# EAGLE design 612_jetracer_esp32s3_030011 (EAGLE 9.6.2)
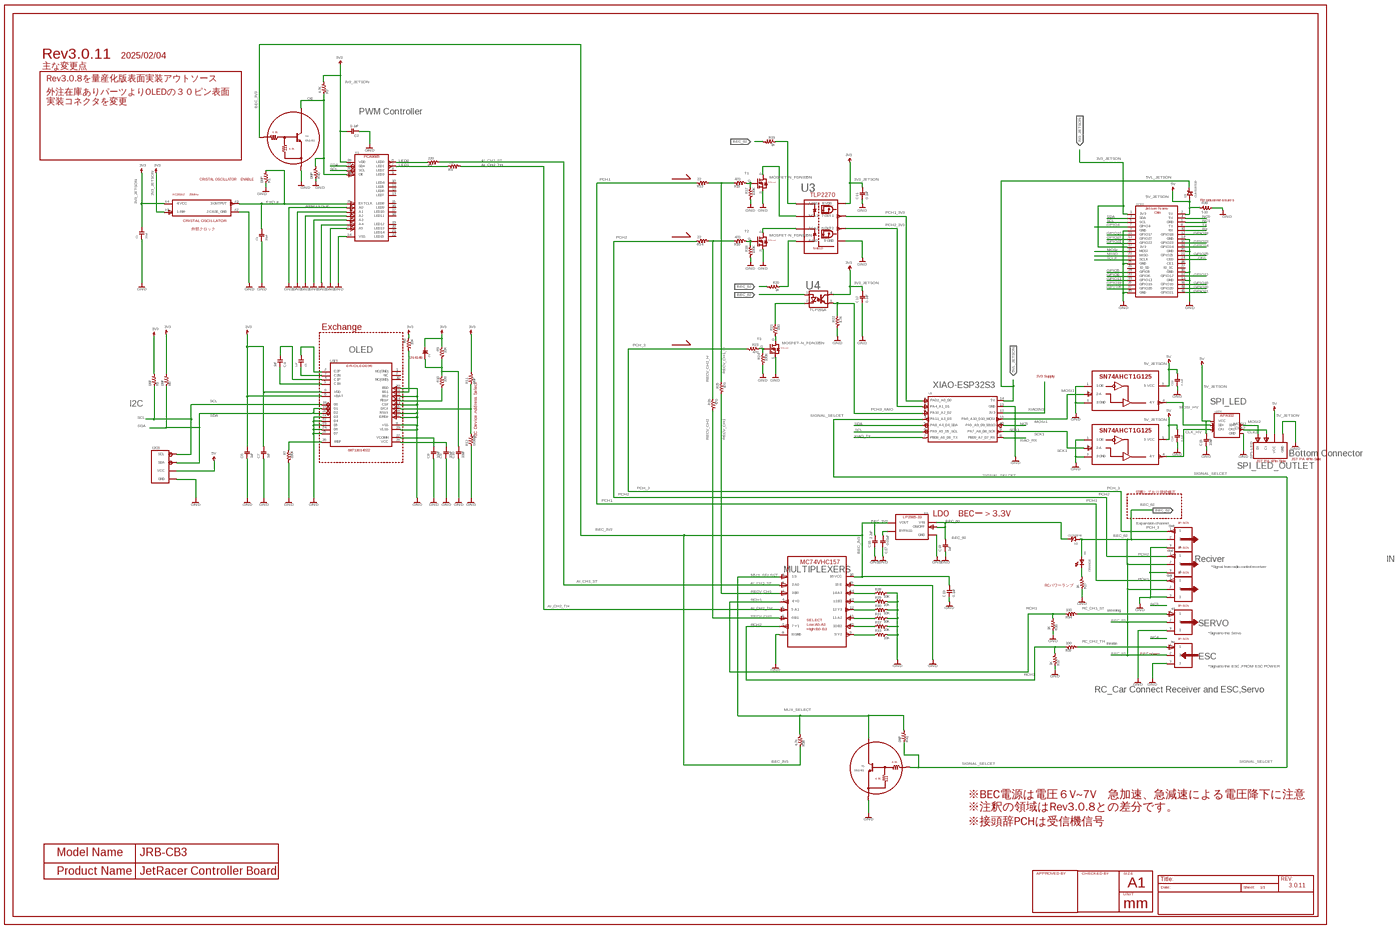
[diagram p0: schematic, sheet 1, overview]
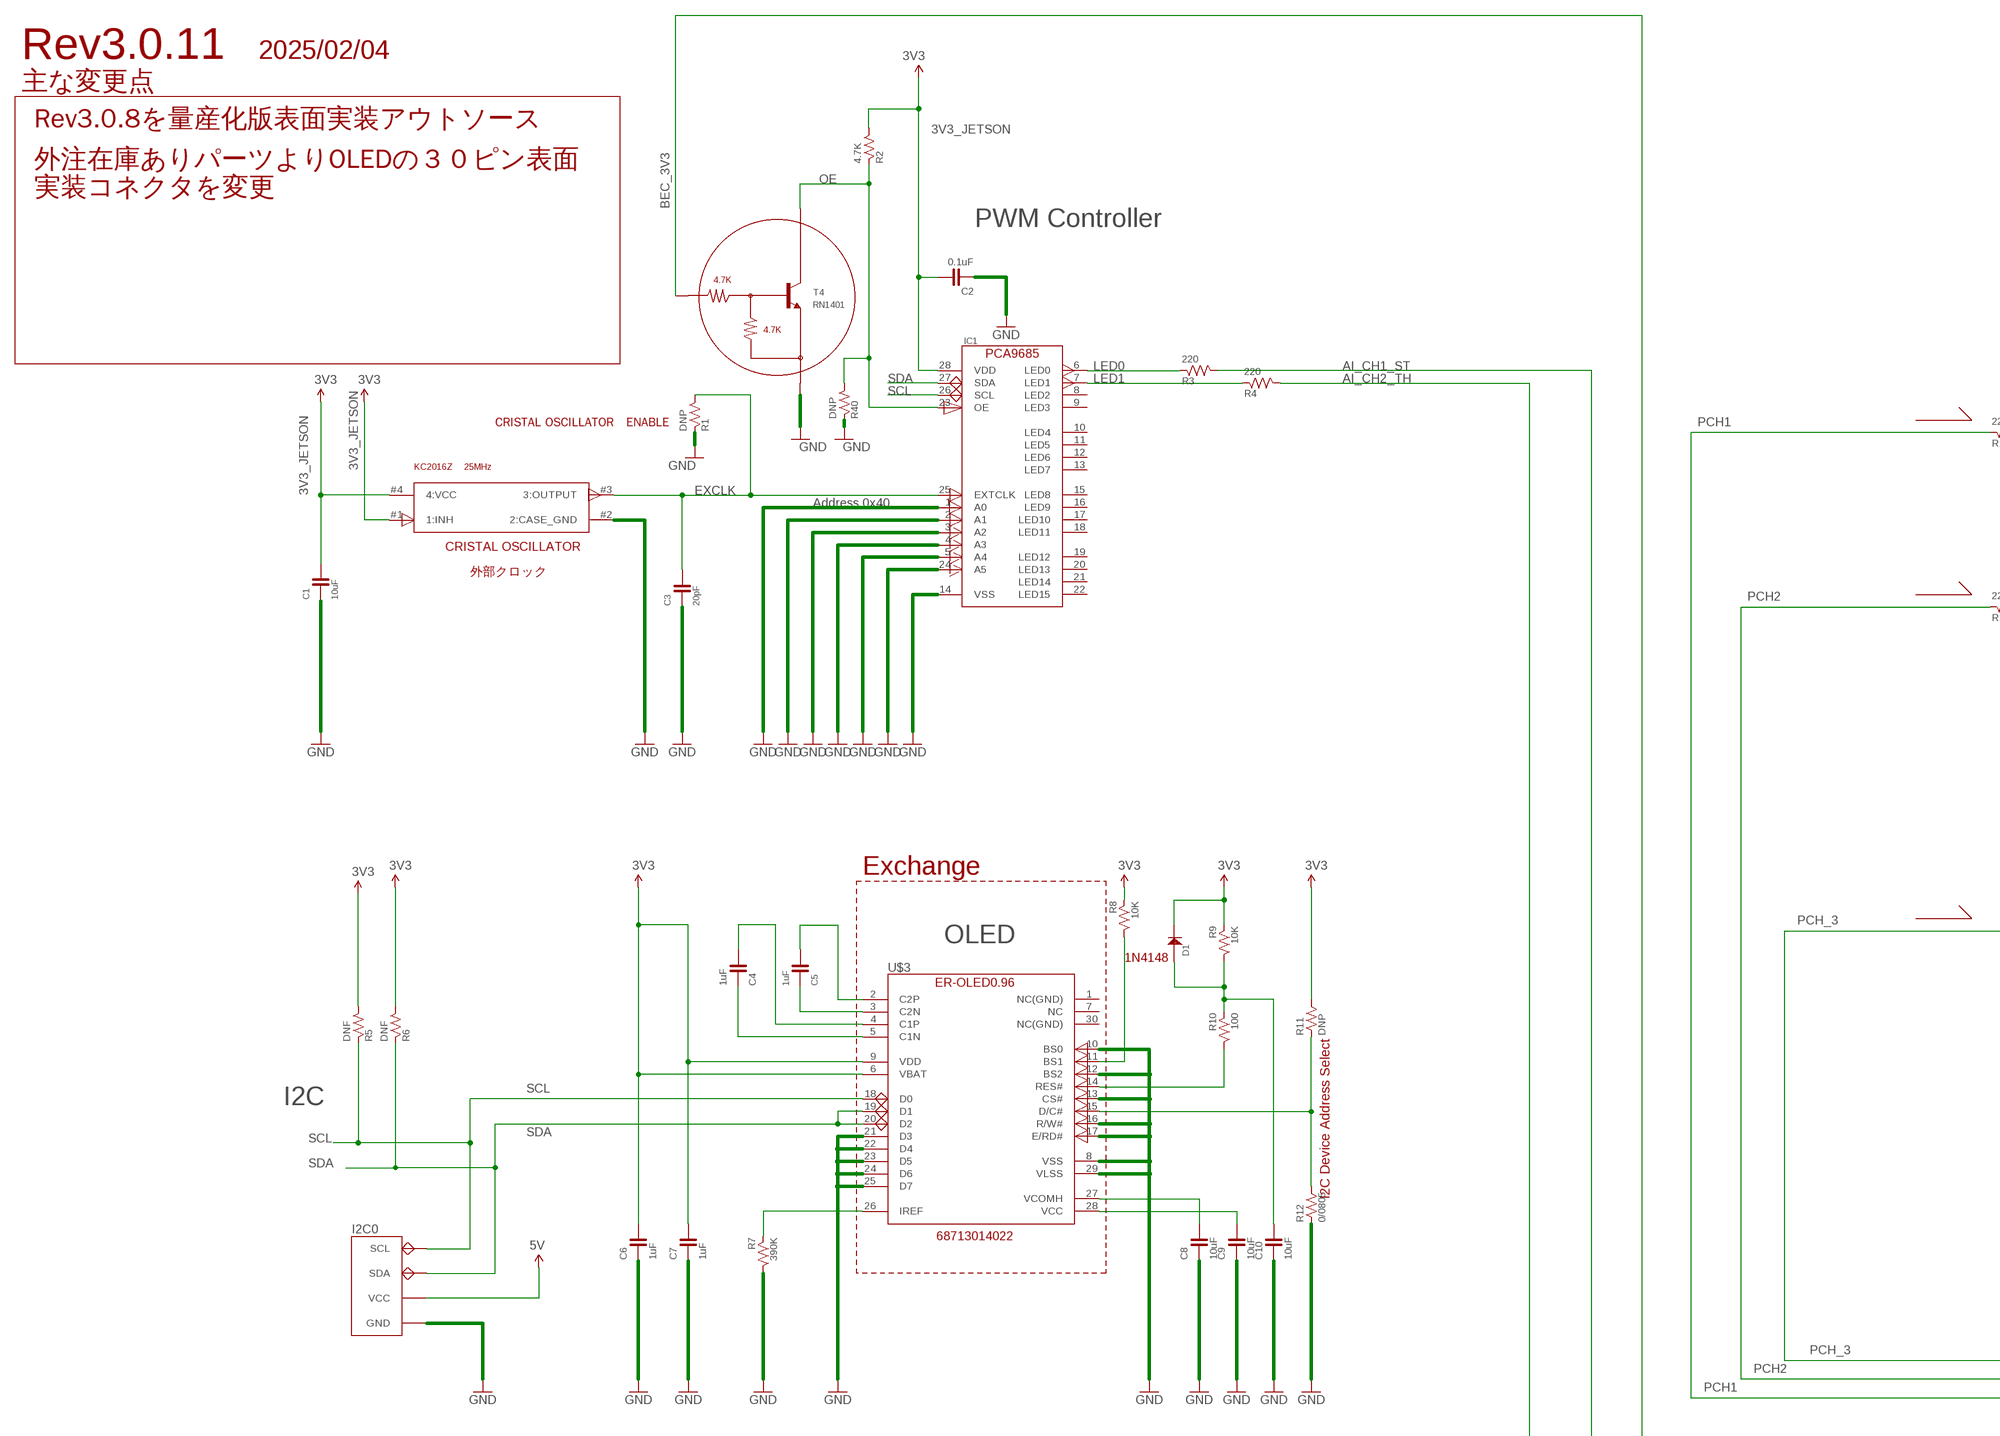
[diagram p1: schematic, sheet 1, part 1 of 4]
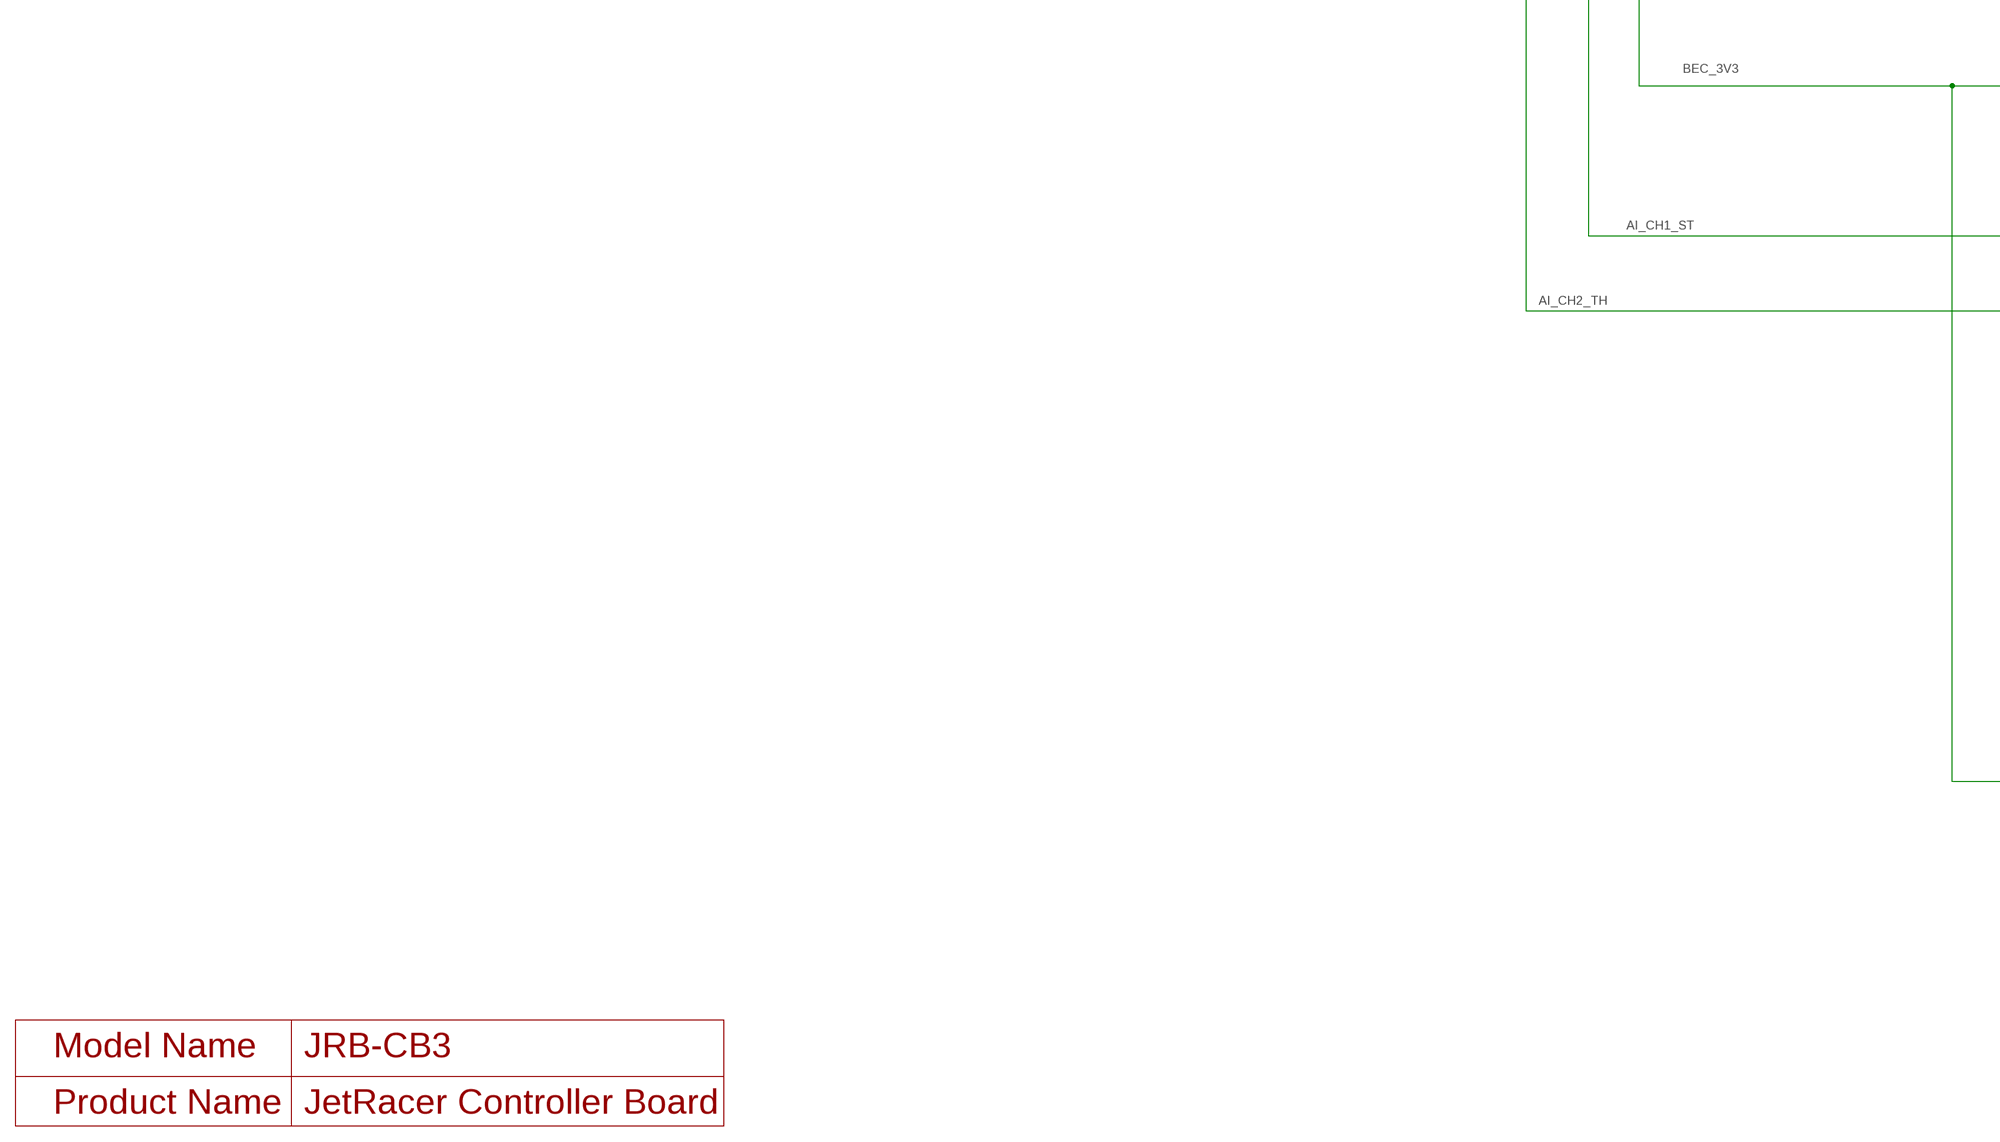
[diagram p2: schematic, sheet 1, part 2 of 4]
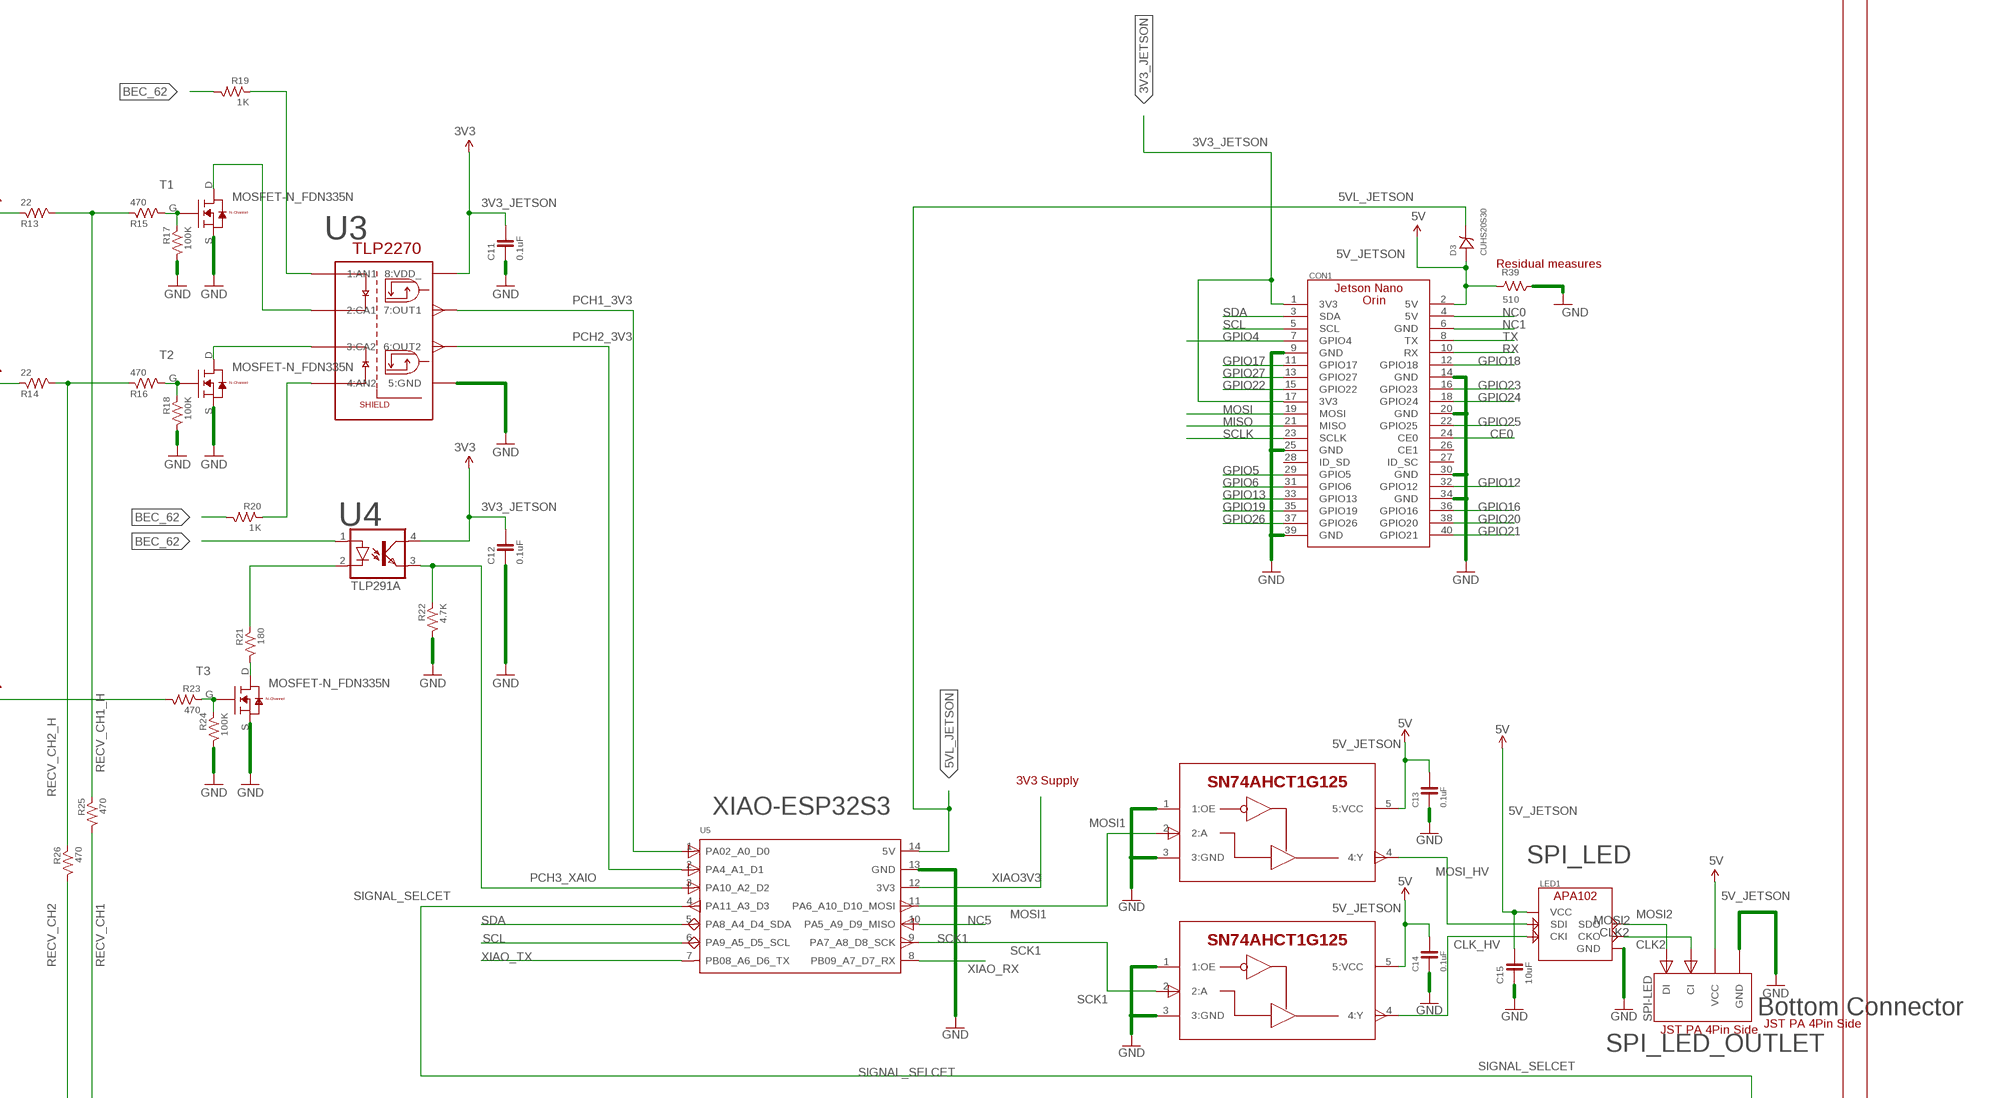
[diagram p3: schematic, sheet 1, part 3 of 4]
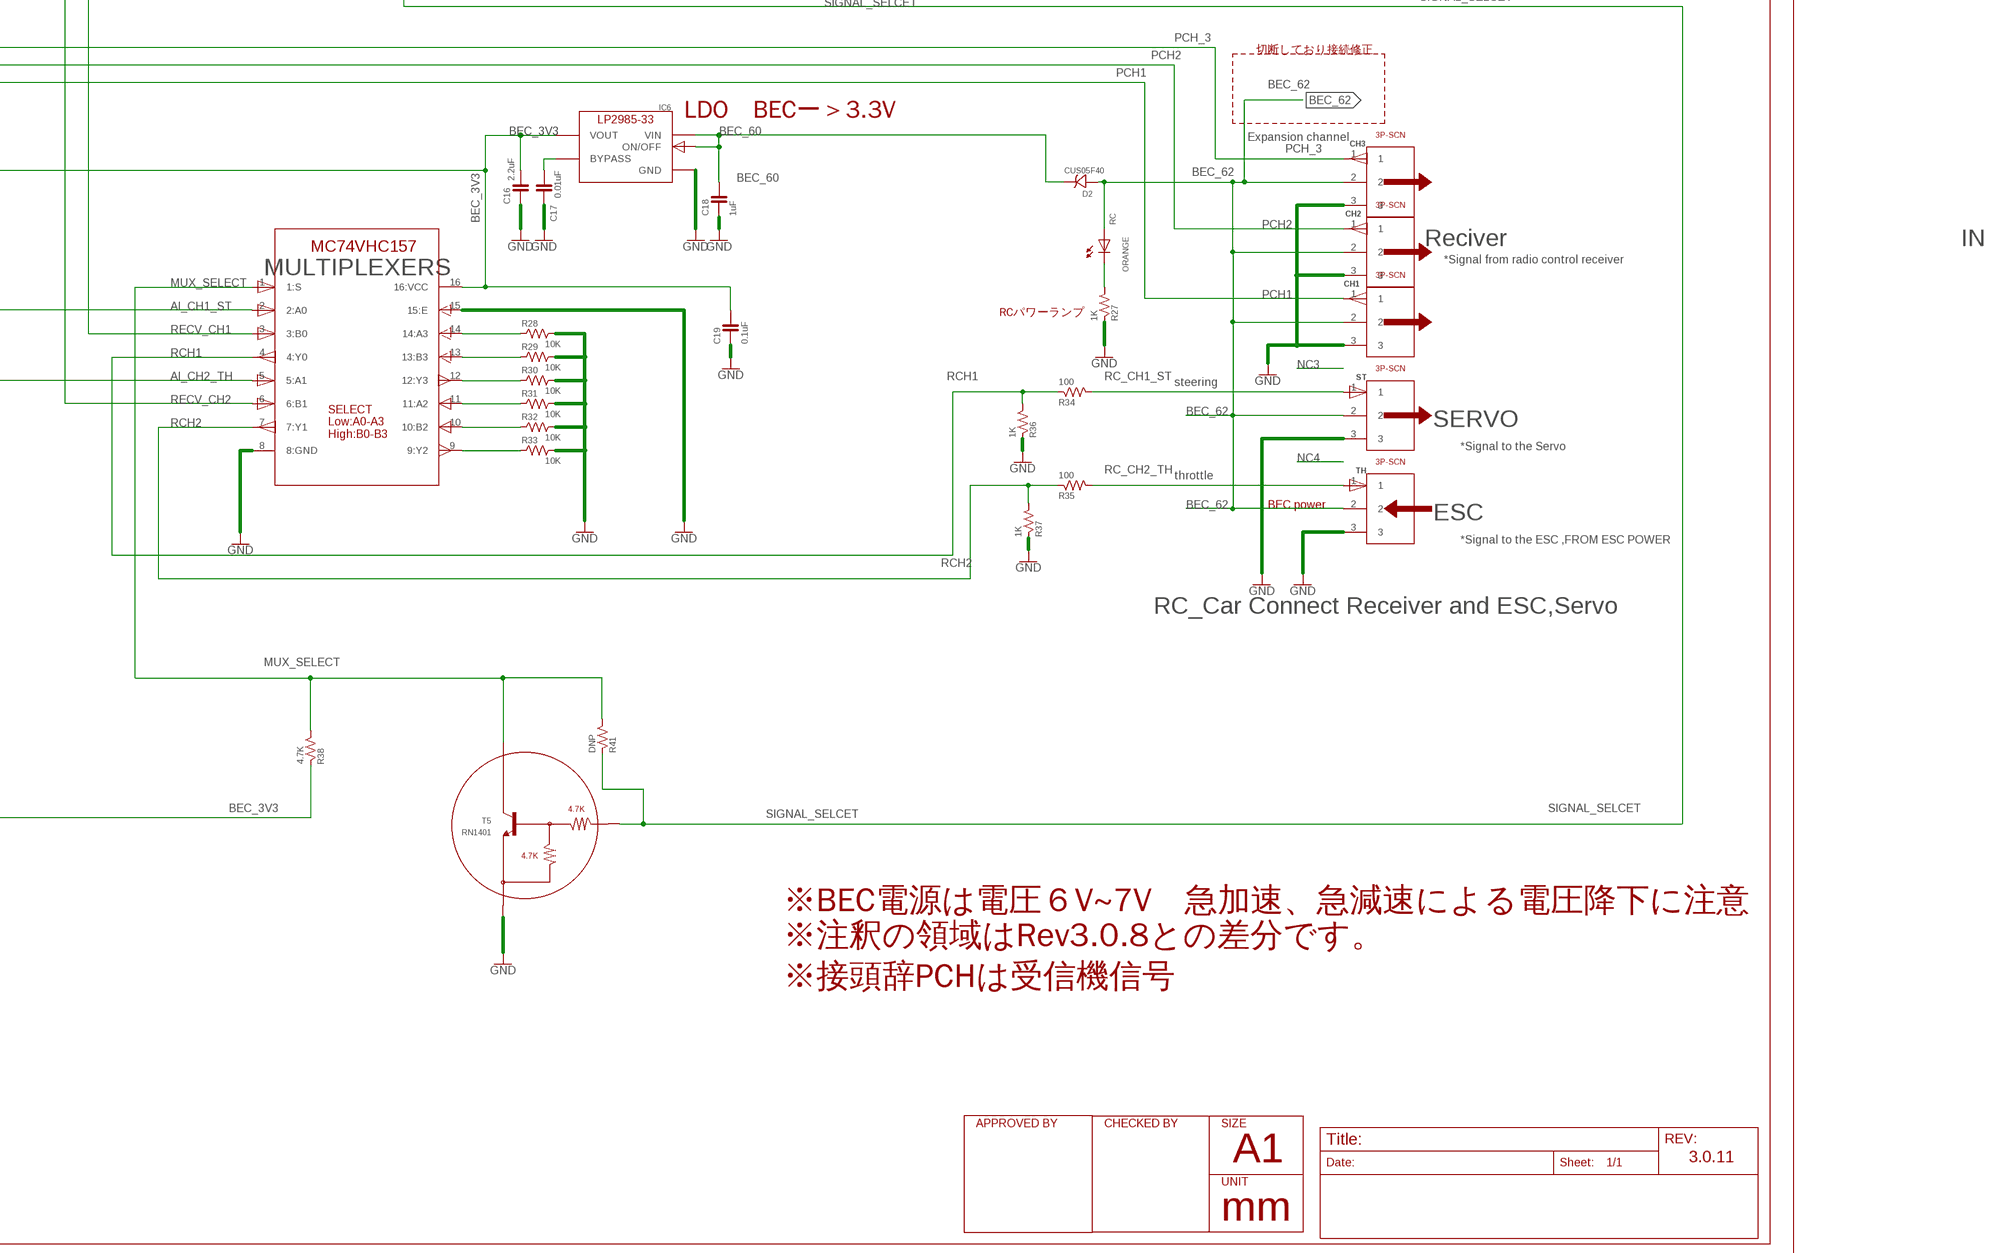
[diagram p4: schematic, sheet 1, part 4 of 4]

## Parts
C1  10uF  CAPACITOR-0402  [0402]
C2  0.1uF  CAPACITOR-0603  [0603]
C3  20pF  CAPACITOR-0402  [0402]
C4  1uF  CAPACITOR-0603  [0603]
C5  1uF  CAPACITOR-0603  [0603]
C6  1uF  CAPACITOR-0603  [0603]
C7  1uF  CAPACITOR-0603  [0603]
C8  10uF  CAPACITOR-0603  [0603]
C9  10uF  CAPACITOR-0603  [0603]
C10  10uF  CAPACITOR-0603  [0603]
C11  0.1uF  CAPACITOR-0603  [0603]
C12  0.1uF  CAPACITOR-0603  [0603]
C13  0.1uF  CAPACITOR-0402  [0402]
C14  0.1uF  CAPACITOR-0402  [0402]
C15  10uF  CAPACITOR-0603  [0603]
C16  2.2uF  CAPACITOR-0603  [0603]
C17  0.01uF  CAPACITOR-0603  [0603]
C18  1uF  CAPACITOR-0603  [0603]
C19  0.1uF  CAPACITOR-0603  [0603]
CH1  3P-SCN  [3P-SCN]
CH2  3P-SCN  [3P-SCN]
CH3  3P-SCN  [3P-SCN]
CON1  JETSON_NANOJETSON_ORIN_NANO  [JETSON_ORIN_NANO_DIMENTION]
D1  1N4148  [1N4148W]
D2  CUS05F40  [CUS05F40]
D3  CUHS20S30  [US2H]
I2C0  FABO_BRICK_I2C-B04B-PASK-1  [FABO_BRICK_I2C_B04B-PASK-1]
IC1  PCA9685PW,BS  [PCA9685]
IC3  SN74AHCT1G125  [SOT-1DOT1]
IC4  SN74AHCT1G125  [SOT-1DOT1]
IC5  MC74VHC157  [MC74VHC157_TSSOP-16]
IC6  LP2985-33DBVR  [SOT-23-5]
LED1  APA102_IPIXEL  [APA102_2020]
R1  DNP  RESISTOR-0603  [0603]
R2  4.7K  RESISTOR-0603  [0603]
R3  220  RESISTOR-0603  [0603]
R4  220  RESISTOR-0603  [0603]
R5  DNF  RESISTOR-0603  [0603]
R6  DNF  RESISTOR-0603  [0603]
R7  390K  RESISTOR-0603  [0603]
R8  10K  RESISTOR-0603  [0603]
R9  10K  RESISTOR-0603  [0603]
R10  100  RESISTOR-0603  [0603]
R11  DNP  RESISTOR-0805  [0805]
R12  0/0805  RESISTOR-0805  [0805]
R13  22  RESISTOR-0603  [0603]
R14  22  RESISTOR-0603  [0603]
R15  470  RESISTOR-0603  [0603]
R16  470  RESISTOR-0603  [0603]
R17  100K  RESISTOR-0603  [0603]
R18  100K  RESISTOR-0603  [0603]
R19  1K  RESISTOR-0603  [0603]
R20  1K  RESISTOR-0603  [0603]
R21  180  RESISTOR-0603  [0603]
R22  4.7K  RESISTOR-0603  [0603]
R23  470  RESISTOR-0603  [0603]
R24  100K  RESISTOR-0603  [0603]
R25  470  RESISTOR-0603  [0603]
R26  470  RESISTOR-0603  [0603]
R27  1K  RESISTOR-0603  [0603]
R28  10K  RESISTOR-0402  [0402]
R29  10K  RESISTOR-0402  [0402]
R30  10K  RESISTOR-0402  [0402]
R31  10K  RESISTOR-0402  [0402]
R32  10K  RESISTOR-0402  [0402]
R33  10K  RESISTOR-0402  [0402]
R34  100  RESISTOR-0603  [0603]
R35  100  RESISTOR-0603  [0603]
R36  1K  RESISTOR-0603  [0603]
R37  1K  RESISTOR-0603  [0603]
R38  4.7K  RESISTOR-0603  [0603]
R39  510  RESISTOR-0805  [0805]
R40  DNP  RESISTOR-0603  [0603]
R41  DNP  RESISTOR-0603  [0603]
RC  ORANGE  LED-0603  [0603]
SPI-LED  FABO-SPI-LED-B04B  [SPI-B04B-PASK-1]
ST  3P-SCN  [3P-SCN]
T1  MOSFET-N_FDN335N  [SUPERSOT-3]
T2  MOSFET-N_FDN335N  [SUPERSOT-3]
T3  MOSFET-N_FDN335N  [SUPERSOT-3]
T4  RN1401  [SC-59]
T5  RN1401  [SC-59]
TH  3P-SCN  [3P-SCN]
U1  KC2016Z  [KC2016Z]
U3  TLP2270  [TLP2270]
U4  TLP291A  [11-3C1]
U5  MOUDLE-SEEEDUINO-XIAO-ESP32C3SINGLESIDE  [MOUDLE14P-DIP_SINGLE]
U$3  68713014022(OLED096)  [68713014022]

## Nets
3V3_JETSON: C1.2 C2.2 C6.2 C7.2 C11.2 C12.2 CON1.1(3V3) CON1.17(3V3) D1.CATHODE IC1.28(VDD) R2.2 R5.2 R6.2 R8.1 R9.1 R11.2 U1.#1(1:INH) U1.#4(4:VCC) U3.8(8:VDD_) U4.4(COL) U$3.6(VBAT) U$3.9(VDD) ; supply symbol labelled 3V3
5V_JETSON: C13.2 C14.2 C15.2 CON1.2(5V) D3.A(ANODE) I2C0.VCC IC3.5(5:VCC) IC4.5(5:VCC) LED1.VCC R39.2 SPI-LED.VCC ; supply symbol labelled 5V
5VL_JETSON: D3.K(CATHODE) U5.14(5V)
AI_CH1_ST: IC5.2(2:A0) R3.2
AI_CH2_TH: IC5.5(5:A1) R4.2
BEC_3V3: C16.2 C19.2 IC5.16(16:VCC) IC6.5(VOUT) R38.1 T4.B
BEC_60: C18.2 D2.C(CATHODE) IC6.1(VIN) IC6.3(ON/OFF)
BEC_62: CH1.2 CH2.2 CH3.2 D2.A(ANODE) R19.2 R20.2 RC.ANODE ST.2 TH.2 U4.1(A)
CE0: CON1.24(CE0)
CLK2: LED1.CKO SPI-LED.CI
CLK_HV: IC4.4(4:Y) LED1.CKI
EXCLK: C3.2 IC1.25(EXTCLK) R1.2 U1.#3(3:OUTPUT)
GND: C1.1 C2.1 C3.1 C6.1 C7.1 C8.1 C9.1 C10.1 C11.1 C12.1 C13.1 C14.1 C15.1 C16.1 C17.1 C18.1 C19.1 CH1.3 CH2.3 CH3.3 CON1.9(GND) CON1.14(GND) CON1.20(GND) CON1.25(GND) CON1.30(GND) CON1.34(GND) CON1.39(GND) I2C0.GND IC1.1(A0) IC1.2(A1) IC1.3(A2) IC1.4(A3) IC1.5(A4) IC1.14(VSS) IC1.24(A5) IC3.1(1:OE) IC3.3(3:GND) IC4.1(1:OE) IC4.3(3:GND) IC5.8(8:GND) IC5.15(15:E) IC6.2(GND) LED1.GND R1.1 R7.2 R12.1 R17.2 R18.2 R22.2 R24.2 R27.1 R28.2 R29.2 R30.2 R31.2 R32.2 R33.2 R36.1 R37.1 R39.1 R40.1 SPI-LED.GND ST.3 T1.S T2.S T3.S T4.E T5.E TH.3 U1.#2(2:CASE_GND) U3.5(5:GND) U5.13(GND) U$3.8(VSS) U$3.10(BS0) U$3.12(BS2) U$3.13(CS#) U$3.16(R/W#) U$3.17(E/RD#) U$3.21(D3) U$3.22(D4) U$3.23(D5) U$3.24(D6) U$3.25(D7) U$3.29(VLSS)
GPIO4: CON1.7(GPIO4)
GPIO5: CON1.29(GPIO5)
GPIO6: CON1.31(GPIO6)
GPIO12: CON1.32(GPIO12)
GPIO13: CON1.33(GPIO13)
GPIO16: CON1.36(GPIO16)
GPIO17: CON1.11(GPIO17)
GPIO18: CON1.12(GPIO18)
GPIO19: CON1.35(GPIO19)
GPIO20: CON1.38(GPIO20)
GPIO21: CON1.40(GPIO21)
GPIO22: CON1.15(GPIO22)
GPIO23: CON1.16(GPIO23)
GPIO24: CON1.18(GPIO24)
GPIO25: CON1.22(GPIO25)
GPIO26: CON1.37(GPIO26)
GPIO27: CON1.13(GPIO27)
LED0: IC1.6(LED0) R3.1
LED1: IC1.7(LED1) R4.1
MISO: CON1.21(MISO)
MOSI: CON1.19(MOSI)
MOSI1: IC3.2(2:A) U5.11(PA6_A10_D10_MOSI)
MOSI2: LED1.SDO SPI-LED.DI
MOSI_HV: IC3.4(4:Y) LED1.SDI
MUX_SELECT: IC5.1(1:S) R38.2 R41.2 T5.C
N$2: IC5.9(9:Y2) R33.1
N$3: C5.2 U$3.2(C2P)
N$4: IC5.10(10:B2) R32.1
N$6: R21.1 U4.2(C)
N$9: R20.1 U3.4(4:AN2)
N$12: R19.1 U3.1(1:AN1)
N$14: R7.1 U$3.26(IREF)
N$16: C4.2 U$3.4(C1P)
N$17: C9.2 U$3.28(VCC)
N$18: R10.2 U$3.14(RES#)
N$19: IC5.11(11:A2) R31.1
N$20: IC5.12(12:Y3) R30.1
N$21: C4.1 U$3.5(C1N)
N$22: C5.1 U$3.3(C2N)
N$23: R23.1 R24.1 T3.G
N$24: R27.2 RC.CATHODE
N$25: C8.2 U$3.27(VCOMH)
N$26: R21.2 T3.D
N$28: T2.D U3.3(3:CA2)
N$30: T1.D U3.2(2:CA1)
N$31: IC5.13(13:B3) R29.1
N$32: C10.2 D1.ANODE R9.2 R10.1
N$33: R15.2 R17.1 T1.G
N$35: IC5.14(14:A3) R28.1
N$37: R11.1 R12.2 U$3.15(D/C#)
N$38: R16.2 R18.1 T2.G
N$40: C17.2 IC6.4(BYPASS)
N$50: R8.2 U$3.11(BS1)
NC0: CON1.4(5V)
NC1: CON1.6(GND)
NC5: U5.10(PA5_A9_D9_MISO)
OE: IC1.23(OE) R2.1 R40.2 T4.C
PCH1: CH1.1 R13.1
PCH1_3V3: U3.7(7:OUT1) U5.1(PA02_A0_D0)
PCH2: CH2.1 R14.1
PCH2_3V3: U3.6(6:OUT2) U5.2(PA4_A1_D1)
PCH3_XAIO: R22.1 U4.3(EMI) U5.3(PA10_A2_D2)
PCH_3: CH3.1 R23.2
RC_CH1_ST: R34.2 ST.1
RC_CH2_TH: R35.2 TH.1
RCH1: IC5.4(4:Y0) R34.1 R36.2
RCH2: IC5.7(7:Y1) R35.1 R37.2
RECV_CH1: IC5.3(3:B0) R25.2
RECV_CH1_H: R13.2 R15.1 R25.1
RECV_CH2: IC5.6(6:B1) R26.2
RECV_CH2_H: R14.2 R16.1 R26.1
RX: CON1.10(RX)
SCK1: IC4.2(2:A) U5.9(PA7_A8_D8_SCK)
SCL: CON1.5(SCL) I2C0.SCL IC1.26(SCL) R5.1 U5.6(PA9_A5_D5_SCL) U$3.18(D0)
SCLK: CON1.23(SCLK)
SDA: CON1.3(SDA) I2C0.SDA IC1.27(SDA) R6.1 U5.5(PA8_A4_D4_SDA) U$3.19(D1) U$3.20(D2)
SIGNAL_SELCET: R41.1 T5.B U5.4(PA11_A3_D3)
TX: CON1.8(TX)
XIAO3V3: U5.12(3V3)
XIAO_RX: U5.8(PB09_A7_D7_RX)
XIAO_TX: U5.7(PB08_A6_D6_TX)
Unconnected: CON1.26(CE1) CON1.27(ID_SC) CON1.28(ID_SD) IC1.8(LED2) IC1.9(LED3) IC1.10(LED4) IC1.11(LED5) IC1.12(LED6) IC1.13(LED7) IC1.15(LED8) IC1.16(LED9) IC1.17(LED10) IC1.18(LED11) IC1.19(LED12) IC1.20(LED13) IC1.21(LED14) IC1.22(LED15) U$3.1(NC(GND)) U$3.7(NC) U$3.30(NC(GND))

## Notes on the sheet
- Rev3.0.11 | 2025/02/04
- 主な変更点
- Rev3.0.8を量産化版表面実装アウトソース
- 外注在庫ありパーツよりOLEDの３０ピン表面
  実装コネクタを変更
- PWM Controller
- CRISTAL OSCILLATOR　ENABLE
- Residual measures
- Address 0x40
- Orin
- CRISTAL OSCILLATOR
- 外部クロック
- Exchange
- OLED
- 1N4148
- 3V3 Supply
- XIAO-ESP32S3
- I2C | SPI_LED
- I2C Device Address Select
- Bottom Connector
- JST PA 4Pin Side
- JST PA 4Pin Side
- SPI_LED_OUTLET
- 切断しており接続修正
- LDO　BECー＞3.3V
- Expansion channel
- Reciver | IN
- *Signal from radio control receiver
- MULTIPLEXERS
- RCパワーランプ
- steering
- SERVO
- SELECT
  Low:A0-A3
  High:B0-B3
- *Signal to the Servo
- throttle
- BEC power
- ESC
- *Signal to the ESC ,FROM ESC POWER
- RC_Car Connect Receiver and ESC,Servo
- ※BEC電源は電圧６V~7V　急加速、急減速による電圧降下に注意
- ※注釈の領域はRev3.0.8との差分です。
- ※接頭辞PCHは受信機信号
- Model Name | JRB-CB3
- Product Name | JetRacer Controller Board
- 3.0.11

## Library data of the parts
C1-C19 = FaBo-Capacitor:CAPACITOR: CAPACITOR
CH1-CH3 ST TH = FaBo-Connetor:3P-SCN
CON1 = FaBo-Boards:JETSON_NANO
D1 = FaBo-Diode:1N4148
D2 = FaBo-Diode:CUS05F40
D3 = FaBo-Diode:CUHS20S30: 30V,2A,temp-50~150,if 0.25V(0.5A),rev 170uA(10V)
I2C0 = FaBo-Template:FABO_BRICK_I2C: FaBo Brick I2C
IC1 = FaBo-Motor:PCA9685PW,BS
IC3 IC4 = FaBo-LogicIC:SN74AHCT1G125: Input TTL logic level level shift
IC5 = FaBo-Multiplexers:MC74VHC157
IC6 = FaBo-Supply:LP2985-33DBVR: LP2985
LED1 = FaBo-LED:APA102
R1-R10 R12 R13 R15-R27 R29 R31-R41 = FaBo-Resistors:RESISTOR: RESISTOR
R11 R14 R28 R30 = FaBo-Resistors:RESISTOR: RESISTOR; SPICEPREFIX: R
RC = FaBo-LED:LED
SPI-LED = FaBo-Connetor:FABO-SPI-LED
T1-T3 = FaBo-Mosfet:MOSFET-N
T4 T5 = FaBo-Transistor:RN1401
U1 = FaBo-Crystal:KC2016Z; SPICEPREFIX: E
U3 = FaBo-Photocoupler:TLP2270
U4 = FaBo_Photocoupler:TLP291A
U5 = FaBo-MPU:MOUDLE-SEEEDUINO-XIAO-ESP32C3
U$3 = FaBo-Connetor:68713014022(OLED096)

## Board
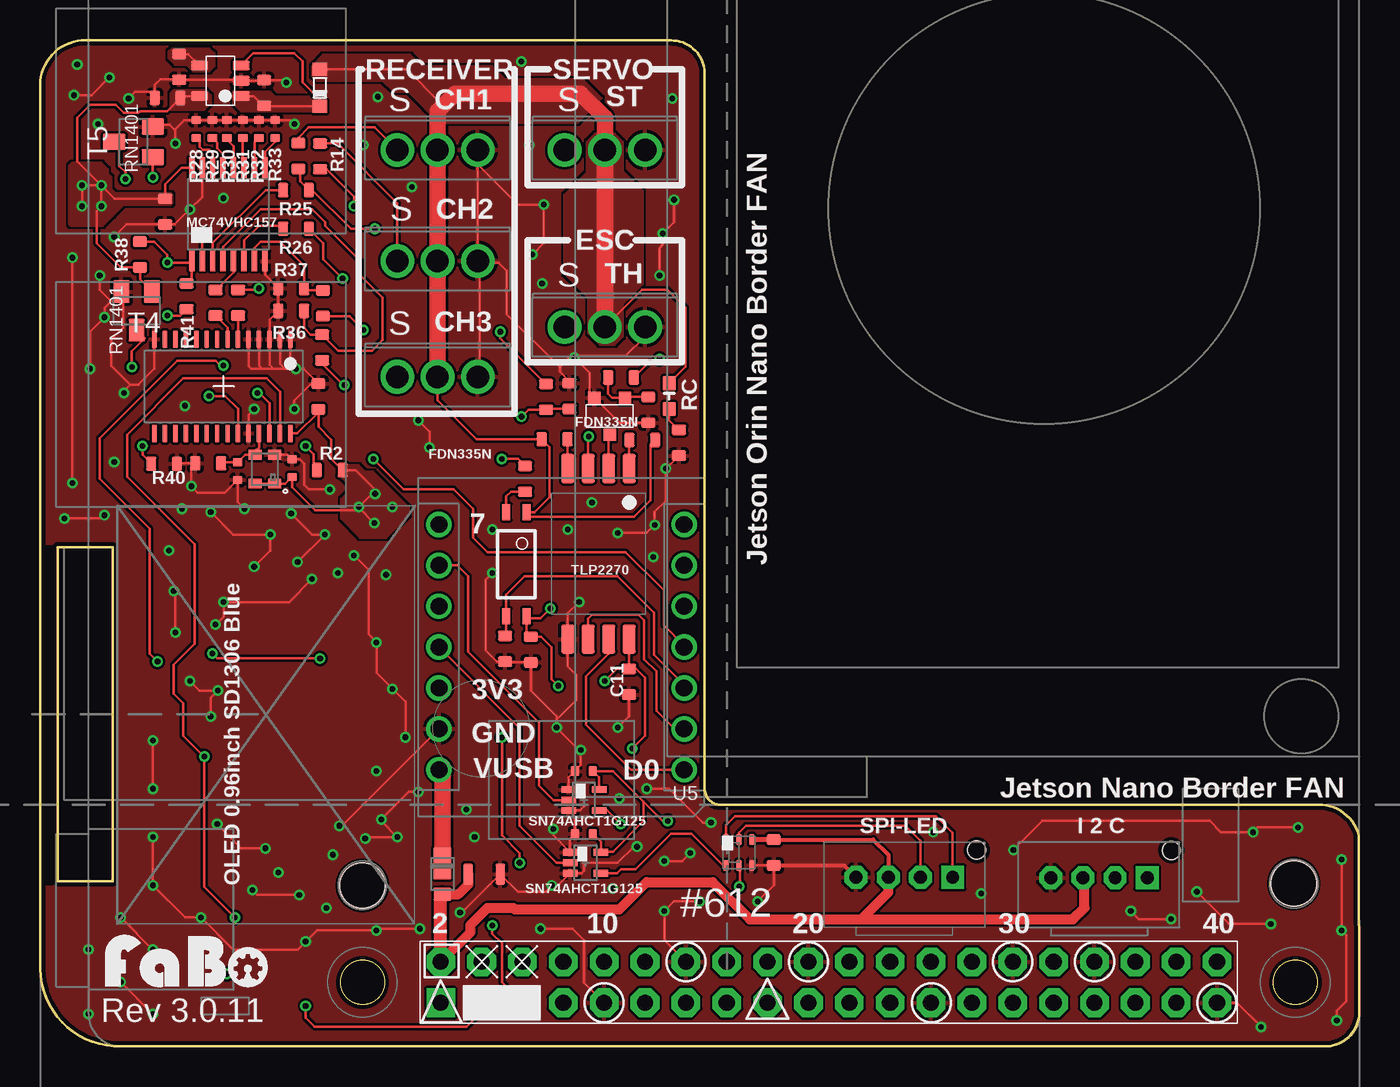
[diagram p5: board, top side]
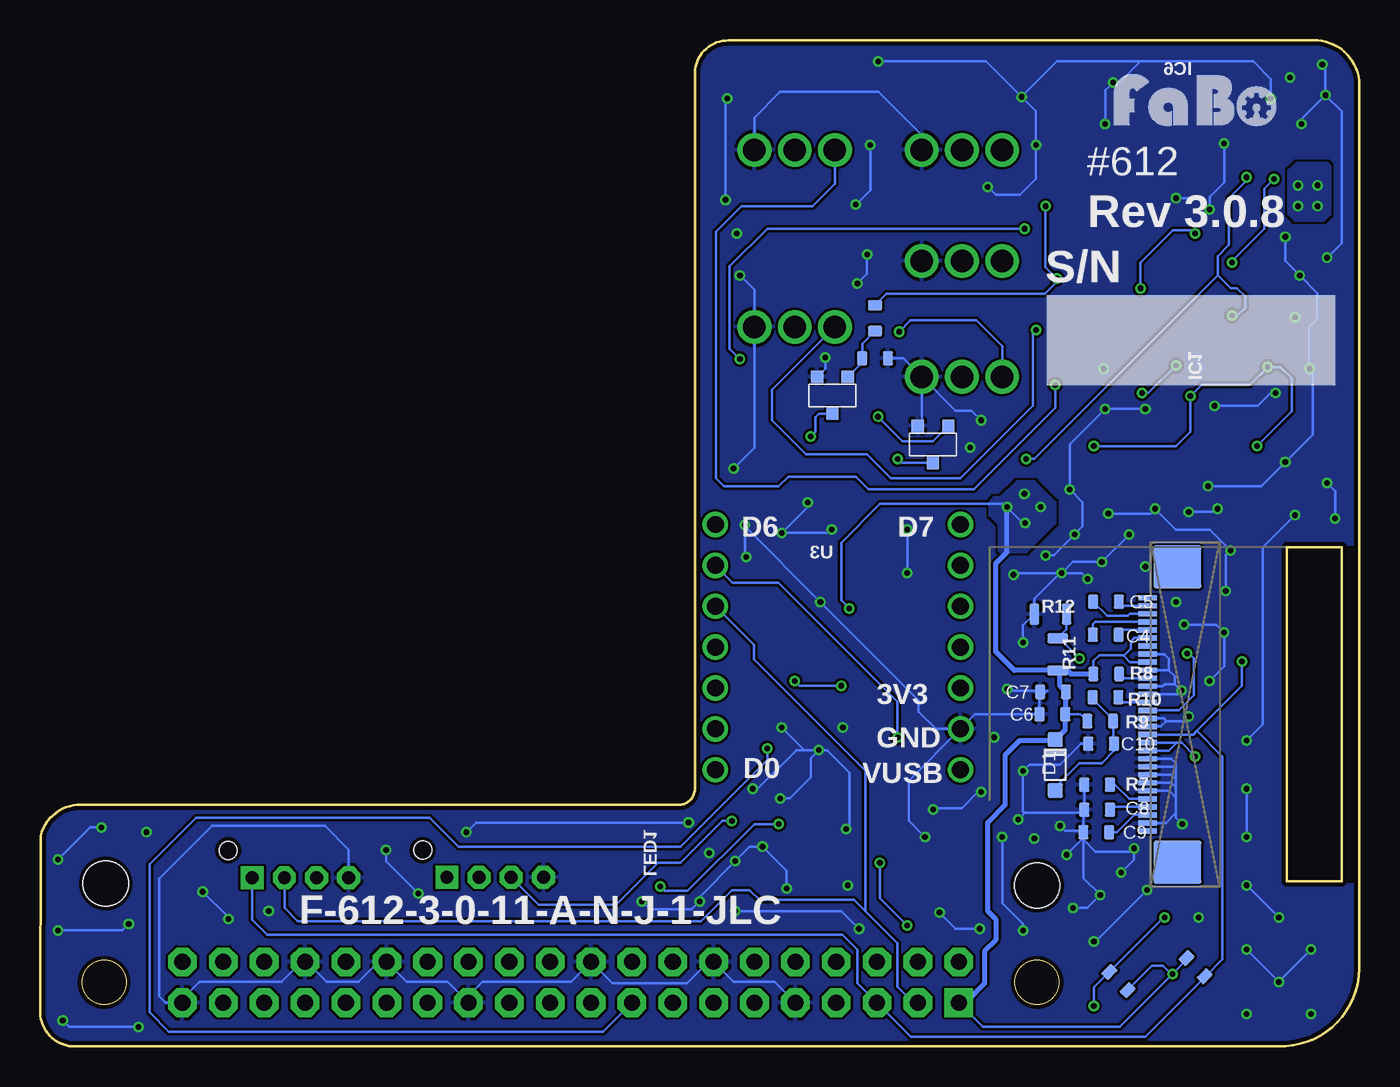
[diagram p6: board, bottom side, seen from below]

Size 82 x 62.53 mm. Coordinates in mm from the lower left corner, seen from the top.
Outline: 79.6,0.01 arc90 82,1.91 81.97,13.1 arc78 79.45,15.01 42.45,15.01 arc-97 41.3,16.01 41.3,60.51 arc90 39.2,62.51 3.1,62.51 arc90 0,60.01 0,4.81 arc85 4.6,0.01 79.6,0.01
Outline: 1.1,31.01 4.5,31.01 4.5,10.25 1.1,10.25 1.1,31.01
Copper layers (1*16): Top 0.035mm / dielectric 1.6mm / Bottom 0.035mm
Design rules "PCBway": minimum track width 6mil, minimum drill 12mil, track to track 6mil, track to pad 6mil, pad to pad 6mil, via to via 6mil, smd to smd 6mil, copper to edge 10mil, drill to drill 10mil, minimum pad ring 10mil, minimum via ring 6mil, stop-mask expansion 2mil, vias tented up to drill 100mil, thermal gap 8mil
Holes 2.8 mm at 20.02,10 77.93,10.12
tRestrict: 6 lines
bRestrict: 11 lines

### Footprints (pad centres in the part's own frame; a part is rotated, then mirrored left to right if it is on the bottom)
0402 = smd 0.5 x 0.6: 1 -0.55,0; 2 0.55,0
0603 = smd 0.65 x 0.9: 1 -0.8,0; 2 0.8,0
3P-SCN = drill 1.4: 1 2.5,0; 2 0,0; 3 -2.5,0
JETSON_ORIN_NANO_DIMENTION = drill 1 pad 1.778 square: 1 21.9,2.7 | drill 1 pad 1.778 octagon: 2 21.9,5.24; 3 24.44,2.7; 4 24.44,5.24; 5 26.98,2.7; 6 26.98,5.24; 7 29.52,2.7; 8 29.52,5.24; 9 32.06,2.7; 10 32.06,5.24; 11 34.6,2.7; 12 34.6,5.24; 13 37.14,2.7; 14 37.14,5.24; 15 39.68,2.7; 16 39.68,5.24; 17 42.22,2.7; 18 42.22,5.24; 19 44.76,2.7; 20 44.76,5.24; 21 47.3,2.7; 22 47.3,5.24; 23 49.84,2.7; 24 49.84,5.24; 25 52.38,2.7; 26 52.38,5.24; 27 54.92,2.7; 28 54.92,5.24; 29 57.46,2.7; 30 57.46,5.24; 31 60,2.7; 32 60,5.24; 33 62.54,2.7; 34 62.54,5.24; 35 65.08,2.7; 36 65.08,5.24; 37 67.62,2.7; 38 67.62,5.24; 39 70.16,2.7; 40 70.16,5.24
1N4148W = smd 0.9 x 0.95: ANODE 0,0; CATHODE 3.15,0
CUS05F40 = smd 0.8 x 0.9: A -1.15,0; C 1.15,0
US2H = smd 0.8 x 1.1: A 1.25,0 | smd 2 x 1.1: K -0.65,0
FABO_BRICK_I2C_B04B-PASK-1 = drill 0.8 pad 1.422 octagon: GND -3,0; SDA 1,0; VCC -1,0 | drill 0.8 pad 1.422 square: SCL 3,0 | hole 1.1: 4.5,1.7
PCA9685 = smd 0.3 x 1.1: 1 -4.15,-2.93; 2 -3.5,-2.93; 3 -2.85,-2.93; 4 -2.2,-2.93; 5 -1.55,-2.93; 6 -0.9,-2.93; 7 -0.25,-2.93; 8 0.4,-2.93; 9 1.05,-2.93; 10 1.7,-2.93; 11 2.35,-2.93; 12 3,-2.93; 13 3.65,-2.93; 14 4.3,-2.93; 15 4.3,2.92; 16 3.65,2.92; 17 3,2.92; 18 2.35,2.92; 19 1.7,2.92; 20 1.05,2.92; 21 0.4,2.92; 22 -0.25,2.92; 23 -0.9,2.92; 24 -1.55,2.92; 25 -2.2,2.92; 26 -2.85,2.92; 27 -3.5,2.92; 28 -4.15,2.92
SOT-1DOT1 = smd 0.4 x 0.95: 1 -0.65,-0.95; 2 0,-0.95; 3 0.65,-0.95; 4 0.65,0.95; 5 -0.65,0.95
MC74VHC157_TSSOP-16 = smd 1.26 x 0.36: 1 -2.9,2.275; 2 -2.9,1.625; 3 -2.9,0.975; 4 -2.9,0.325; 5 -2.9,-0.325; 6 -2.9,-0.975; 7 -2.9,-1.625; 8 -2.9,-2.275; 9 2.9,-2.275; 10 2.9,-1.625; 11 2.9,-0.975; 12 2.9,-0.325; 13 2.9,0.325; 14 2.9,0.975; 15 2.9,1.625; 16 2.9,2.275
SOT-23-5 = smd 0.6 x 1.05: 1 -0.95,-1.3; 2 0,-1.3; 3 0.95,-1.3; 4 0.95,1.3; 5 -0.95,1.3
APA102_2020 = smd 0.7 x 0.35: CKI 0.8,0; CKO -0.8,0; GND 0.8,0.8; SDI 0.8,-0.8; SDO -0.8,-0.8; VCC -0.8,0.8
0805 = smd 0.6 x 1.3: 1 -1,0; 2 1,0
0603' = smd 0.9 x 0.8: ANODE -0.8,0; CATHODE 0.8,0
SPI-B04B-PASK-1 = drill 0.8 pad 1.422 octagon: CI 1,0.02; GND -3,0.02; VCC -1,0.02 | drill 0.8 pad 1.422 square: DI 3,0.02 | hole 1.1: 4.5,1.72
SUPERSOT-3 = smd 0.76 x 0.76: D 0,1.15; G -0.95,-1.15; S 0.95,-1.15
SC-59 = smd 1 x 1.4: B -0.95,-1.2; C 0,1.2; E 0.95,-1.2
KC2016Z = smd 0.6 x 0.8: #1 -0.9,-0.6; #2 0.9,-0.6; #3 0.9,0.6; #4 -0.9,0.6
TLP2270 = smd 0.8 x 1.8: 1 -1.905,-5.3; 2 -0.635,-5.3; 3 0.635,-5.3; 4 1.905,-5.3; 5 1.905,5.3; 6 0.635,5.3; 7 -0.635,5.3; 8 -1.905,5.3
11-3C1 = smd 1 x 0.5: 1 -3.24,0.635; 2 -3.24,-0.635; 3 3.24,-0.635; 4 3.24,0.635
MOUDLE14P-DIP_SINGLE = drill 1.05: 1 1.27,18.12; 2 1.27,15.58; 3 1.27,13.04; 4 1.27,10.5; 5 1.27,7.96; 6 1.27,5.42; 7 1.27,2.88; 8 16.51,2.88; 9 16.51,5.42; 10 16.51,7.96; 11 16.51,10.5; 12 16.51,13.04; 13 16.51,15.58; 14 16.51,18.12
68713014022 = smd 0.3 x 1.2: 1 7.25,2.35; 2 6.75,2.35; 3 6.25,2.35; 4 5.75,2.35; 5 5.25,2.35; 6 4.75,2.35; 7 4.25,2.35; 8 3.75,2.35; 9 3.25,2.35; 10 2.75,2.35; 11 2.25,2.35; 12 1.75,2.35; 13 1.25,2.35; 14 0.75,2.35; 15 0.25,2.35; 16 -0.25,2.35; 17 -0.75,2.35; 18 -1.25,2.35; 19 -1.75,2.35; 20 -2.25,2.35; 21 -2.75,2.35; 22 -3.25,2.35; 23 -3.75,2.35; 24 -4.25,2.35; 25 -4.75,2.35; 26 -5.25,2.35; 27 -5.75,2.35; 28 -6.25,2.35; 29 -6.75,2.35; 30 -7.25,2.35 | smd 2.7 x 3: P$31 9.18,0.49; P$32 -9.18,0.49

### Placement (x,y rotation side)
C1  15.66,35.94 270 top
C2  17.3,40.39 270 top
C3  12.27,35.75 90 top
C4  15.77,25.58 180 bottom
C5  15.75,27.63 0 bottom
C6  19.08,20.64 0 bottom
C7  19.04,22.03 0 bottom
C8  16.3,14.71 0 bottom
C9  16.35,13.31 0 bottom
C10  16.05,18.81 0 bottom
C11  36.6,22.66 90 top
C12  30.5,24.66 90 top
C13  33.8,17.11 0 top
C14  33.8,13.21 0 top
C15  45.6,12.05 90 top
C16  7.92,58.95 0 top
C17  8.64,60.87 90 top
C18  13.92,59.26 270 top
C19  7.76,51.88 90 top
CH1  24.7,55.71 180 top
CH2  24.7,48.81 180 top
CH3  24.7,41.61 180 top
CON1  3,0.01 0 top
D1  18.9,15.91 90 bottom
D2  17.39,59.57 270 top
D3  25,10.71 270 top
I2C0  65.82,10.48 0 top
IC1  11.4,41.01 180 top
IC3  33.9,11.41 270 top
IC4  33.8,15.31 270 top
IC5  11.7,51.71 90 top
IC6  11.2,60.01 90 top
LED1  43.43,12.05 270 top
R1  10.44,36.24 0 top
R2  18,35.81 0 top
R3  12.3,46.21 90 top
R4  10.9,46.21 90 top
R5  10.18,4.93 135 bottom
R6  14.97,4.07 315 bottom
R7  16.3,16.26 180 bottom
R8  15.73,23.15 0 bottom
R9  16.1,20.21 0 bottom
R10  15.78,21.7 0 bottom
R11  18.75,24.36 270 bottom
R12  19.2,26.86 0 bottom
R13  16.05,55.33 270 top
R14  17.4,55.31 270 top
R15  36.11,41.58 180 top
R16  30.1,45.26 270 bottom
R17  37.8,39.56 270 top
R18  30.1,42.76 0 bottom
R19  37.42,37.68 0 top
R20  31.98,37.73 180 top
R21  30.14,35.27 90 top
R22  28.9,24.71 270 top
R23  31.45,40.36 90 top
R24  32.9,40.41 90 top
R25  15.9,53.21 180 top
R26  15.9,50.81 180 top
R27  39.7,37.51 90 top
R28  9.7,57.01 90 top
R29  10.7,57.01 90 top
R30  11.6,57.01 90 top
R31  12.6,57.01 90 top
R32  13.6,57.01 90 top
R33  14.6,57.01 90 top
R34  17.52,43.43 270 top
R35  17.57,46.18 270 top
R36  15.6,45.71 0 top
R37  15.6,47.11 0 top
R38  6.2,49.21 90 top
R39  27.6,10.71 180 top
R40  7.7,36.21 180 top
R41  9.1,46.61 90 top
RC  ORANGE  [0603']  39.1,40.41 270 top
SPI-LED  53.72,10.48 0 top
ST  35.1,55.71 180 top
T1  35.4,39.16 180 top
T2  32.75,40.46 180 bottom
T3  26.5,37.41 180 bottom
T4  6,45.71 180 top
T5  5.8,56.21 90 top
TH  35.1,44.71 180 top
U1  13.97,35.87 90 top
U3  34.7,30.61 180 top
U4  29.6,29.96 270 top
U5  41.3,35.31 180 top
U$1  [LOGO_FABO_M]  9.1,3.31 0 top
U$2  [LOGO_FABO_M]  10.2,56.81 0 bottom
U$3  10.81,20.63 90 bottom

### Tracks (layer width: path | path; a pad name or v marks a point on that pad's centre or on a via)
3V3_JETSON  (via drill 0.35)
  Top 0.152: IC1.28 15.98,38.09 17.3,39.41 C2.2 17.3,38.52 18.1,37.71 18.1,36.51 R2.2 19.6,35.81 20.82,34.59 v20.82,34.34 20.63,34.34 v19.8,33.51 | U4.4 30.23,26.61 | 30.23,26.61 30.23,25.73 C12.2 31.15,25.46 31.8,24.81 31.8,22.81 v32.2,22.41 | U3.8 C11.2 | v35.1,22.71 35.85,23.46 C11.2 | C11.2 37.05,23.46 37.6,22.91 37.6,19.31 v36.8,18.51 | v31.7,27.21 31.1,26.61 30.23,26.61 | U1.#4 U1.#1 15.24,34.97 C1.2 15.66,34.75 17.1,33.31 19.6,33.31 v19.8,33.51 | v20.77,32.52 19.8,33.49 v19.8,33.51
  Bottom 0.152: R5.2 10.74,5.37 v11.6,4.51 11.65,4.46 | CON1.1 23.4,1.21 14.9,1.21 11.65,4.46 | v32.2,22.41 34.8,22.41 v35.1,22.71 | R9.1 17.33,20.64 C6.2 | 18.9,23.36 R11.2 | v31.7,27.21 32.2,27.71 32.2,31.31 29.8,33.71 22.1,33.71 v21.9,33.51 | v36.8,18.51 36.8,17.81 42.2,12.41 56,12.41 57.8,14.21 72.3,14.21 75.2,11.31 75.2,2.11 74,0.91 47.02,0.91 CON1.17 | R6.2 12.89,5.01 12.2,5.01 11.65,4.46 | 21.9,33.43 v21.9,33.51 | v21.9,33.51 20.91,32.52 v20.77,32.52 | U$3.9 14.25,23.88 14.64,24.27 | R8.1 16.53,23.95 16.17,24.31 14.68,24.31 14.64,24.27 | U$3.6 13.98,25.38 14.21,25.15 14.21,24.7 14.64,24.27
  Bottom 0.305: CON1.1 24.5,2.71 23.3,3.91 23.3,5.91 22.6,6.61 22.6,7.91 23.1,8.41 23.1,13.91 22,15.01 22,18.11 21.1,19.01 18.95,19.01 D1.CATHODE 18.3,19.66 18.3,20.62 C6.2 18.28,21.99 C7.2 18.6,22.39 18.6,23.36 | 18.6,23.36 18.15,23.36 17.93,23.15 R8.1 | 18.6,23.36 18.9,23.36 | R11.2 21.45,23.36 22.6,24.51 22.6,30.01 21.9,30.71 21.9,33.43
  pour Top (no thermals): 18.7,32.81 18.7,34.01 19.1,34.41 19.1,35.01 18.8,35.31 18.8,36.01 18.9,36.11 19.8,36.11 20.2,35.71 20.7,35.71 22.9,33.51 22.9,33.01 21.5,31.61 19.9,31.61
  pour Bottom (no thermals): 20.7,30.71 18.9,32.51 18.9,33.81 20.2,35.11 21.3,35.11 22.3,34.11 22.7,34.11 23.1,33.71 23,33.61 23,33.01 22.4,32.41 22.4,30.81 22.3,30.71
5V_JETSON  (via drill 0.35)
  Top 0.152: C14.2 34.85,12.71 34.85,12.11 | 34.85,12.11 IC3.5 | IC4.5 34.75,16.71 C13.2 35.6,17.11 37.5,15.21 | 37.5,15.21 37.5,14.01 35.6,12.11 34.85,12.11 | 37.5,15.21 38.7,14.01 v39,14.01
  Top 0.254: C15.2 51.78,12.85 52.72,11.91 SPI-LED.VCC
  Top 0.305: C15.2 LED1.VCC
  Top 0.61: R39.2 26.6,10.06 26,9.46 D3.A | CON1.2 26.74,7.09 26.74,7.55 27.8,8.61 29.4,8.61 29.5,8.51 36,8.51 37.7,10.21 41.8,10.21 44.11,7.9 51.05,7.9 | 51.05,7.9 52.72,9.57 SPI-LED.VCC | 51.05,7.9 64.21,7.9 64.91,8.6 64.91,10.39 I2C0.VCC
  Top 0.813: CON1.2 24.9,9.36 D3.A
  Bottom 0.152: v39,14.01 39.6,14.01 42.2,11.41 43.6,11.41 46.2,8.81 51.03,8.81 SPI-LED.VCC
5VL_JETSON
  Top 1.016: D3.K 25,16.98 U5.14
AI_CH1_ST  (via drill 0.35)
  Top 0.152: v10.2,50.51 10.08,50.4 10.07,50.41 IC5.2 | v13.6,47.11 13.5,47.01 R3.2
  Bottom 0.152: v13.6,47.11 13.6,48.71 11.6,50.71 10.4,50.71 v10.2,50.51
AI_CH2_TH
  Top 0.152: IC5.5 12.02,48.11 10.93,47.01 R4.2
BEC_3V3  (via drill 0.35)
  Top 0.152: IC6.5 8.84,59.06 C16.2 7.89,58.11 6.2,58.11 6.1,58.01 5.2,58.01 4.7,58.51 3.1,58.51 2.3,57.71 2.3,55.01 v3.8,53.51 | v3.8,53.51 4.63,52.68 C19.2 7.76,53.57 8.8,54.61 IC5.16 | v2.6,52.21 v2.6,53.51 v3.8,53.51 | v3.8,53.51 v3.8,52.21 3.5,51.91 3.5,49.91 5,48.41 R38.1 6.2,47.66 T4.B
  pour Top (no thermals): 8.1,58.21 8.1,59.21 8.3,59.41 10.3,59.41 10.6,59.11 10.6,58.61 10.2,58.21
  pour Bottom (no thermals): 1.8,51.71 1.8,54.71 2,54.91 3.9,54.91 4.2,54.61 4.4,54.41 4.4,52.51 4.4,51.71 4,51.31 2.2,51.31
  pour Top (no thermals): 1.8,51.71 1.8,54.71 1.9,54.81 2,54.91 3.8,54.91 4.2,54.51 4.2,54.21 4.4,54.01 4.4,53.31 4.7,53.01 7.3,53.01 8.1,53.01 8.2,52.91 8.2,52.41 8.1,52.31 5.2,52.31 4.5,51.61 3.9,51.01 2.1,51.01 1.9,51.01 1.8,51.11
BEC_60
  Top 0.152: 13.92,58.41 C18.2 | IC6.1 13.27,59.06 13.92,58.41 | D2.C | D2.C 13.92,58.41 | D2.C 17.38,58.83 16.3,59.91 16.3,61.21 15.8,61.71 13.25,61.71 IC6.3
  pour Top (no thermals): 12,58.61 12,59.31 14.3,59.31 14.6,59.01 16.7,59.01 17.2,58.51 17.2,58.11 12.5,58.11
BEC_62
  Top 0.152: R19.2 37.92,37.38 37.92,33.94 36.9,32.91 30.52,32.91 U4.1 30.73,33.2 31.68,34.14 31.68,37.23 R20.2 27.13,37.73 24.7,40.16 CH3.2 | D2.A 22.8,60.72 24.8,58.71 24.8,55.81 CH1.2 | RC.ANODE 40.11,42.22 40.11,45.89 38.99,47.01 37.4,47.01 TH.2
  Top 1.016: TH.2 ST.2 35.1,57.71 33.6,59.21 25.8,59.21 24.7,58.11 CH1.2 CH2.2 CH3.2
  pour Top (no thermals): 16.9,60.31 16.9,60.91 17.6,61.61 23,61.61 23.7,60.91 28.1,60.91 28.9,60.11 33.7,60.11 34.9,58.91 33.4,57.41 26.9,57.41 24.8,57.41 22.9,59.31 22,59.31 21.3,60.01 17.2,60.01
  pour Top (no thermals): 34.1,44.31 34.1,46.51 32.6,48.01 32.6,52.91 34,54.31 34,56.21 34.5,56.71 35.7,56.71 36.2,56.21 36.2,54.41 37.45,53.16 37.45,47.36 36.2,46.11 36.2,44.11 35.7,43.61 34.8,43.61
CLK2
  Top 0.152: LED1.CKO 43.43,13.27 43.87,13.71 53.8,13.71 54.72,12.79 SPI-LED.CI
CLK_HV  (via drill 0.35)
  Top 0.152: IC4.4 35.25,14.66 v36.1,13.81 | v43.46,9.94 43.5,9.98 43.5,11.18 LED1.CKI
  Bottom 0.152: v43.46,9.94 43.18,9.66 41.75,9.66 37.6,13.81 v36.1,13.81
EXCLK
  Top 0.152: IC1.25 13.6,37.21 13.37,36.98 U1.#3 12.74,36.77 C3.2 11.31,36.3 R1.2
GND  (via drill 0.35)
  Top 0.152: T4.E 5.05,46.31 | 5.6,41.11 4.4,42.31 4.4,43.91 5.15,44.66 5.15,46.31 5.05,46.31 | 5.6,41.11 6.1,41.11 7.1,42.11 IC1.14 | CH3.3 27.3,41.71 27.3,48.71 | v33.2,42.81 34.15,41.86 34.15,40.61 T1.S 36,38.76 R17.2 | T5.E 7.1,57.26 8.05,57.26 8.35,56.96 | 8.6,60.11 C17.1 12.45,60.07 IC6.2 13.88,60.01 C18.1 15.16,60.06 v15.3,59.91 | 8.6,60.11 8.7,60.11 | v5.5,58.91 5.9,59.31 6.75,59.31 C16.1 7.12,59.76 7.48,60.11 8.6,60.11 | v4.6,50.31 5.37,51.08 C19.1 8.37,51.08 v9.3,52.01 10.07,52.78 IC5.15 | v3.7,47.91 3.7,47.01 4.4,46.31 | 5.05,46.31 4.4,46.31 | v33.2,42.81 33.3,42.91 36.4,42.91 37.6,44.11 TH.3 | R27.1 v38.9,35.91 38.9,33.91 38.2,33.21 v38.2,32.41 37.7,31.91 v35.9,31.91 | IC3.1 32.95,12.91 C14.1 33.25,14.26 IC4.3 33.55,14.66 33.8,14.91 33.8,15.71 33.55,15.96 IC4.1 32.85,16.71 C13.1 33.6,17.46 v33.6,18.41 33.5,18.41 v32.1,19.81 32.1,20.31 | IC3.1 33.55,12.06 33.8,11.81 33.8,11.41 | 33.8,11.41 33.8,10.91 33.65,10.76 IC3.3 32.2,10.01 v31.8,10.01 31.4,9.61 29.7,9.61 R39.1 26.2,8.31 v26.1,8.31 | LED1.GND C15.1 45.6,10.01 v44.6,9.01 | 27.3,48.71 CH2.3 CH1.3 27.2,54.81 29.7,52.31 v31.3,52.31 31.3,49.91 v30.6,49.21 | v10.6,20.51 10.6,21.66 v11.06,22.11 9.9,22.11 v9.3,22.71 | U5.13 18.77,13.71 v18.6,13.71 | v33.5,27.61 32.8,26.91 U3.5 32.8,23.62 33.3,23.11 33.3,21.51 32.1,20.31 | C11.1 36.6,20.51 v35.9,19.81 | CON1.9 33.8,3.97 33.8,6.61 33.1,7.31 v31.1,7.31 | v14,12.31 12.5,12.31 v11,13.81 | U1.#2 15.38,36.77 C1.1 16.12,36.49 16.4,36.21 16.4,34.91 16.7,34.61 v18,34.61 | R40.1 8.53,36.24 R1.1 9.4,36 v9.4,34.81 9.8,34.41 11.48,34.41 C3.1 12.27,33.84 v12.7,33.41 | v15.9,42.11 16.37,42.11 C2.1 17.3,41.11 16.8,41.11 15.8,40.11 v15.8,39.61
  Top 0.152: IC1.1 15.55,42.46 v15.9,42.11 | IC1.2 14.9,42.41 15.2,42.11 | 15.2,42.11 v15.9,42.11 | 14.5,42.11 15.2,42.11 | 14.5,42.11 14.25,42.36 IC1.3 14.25,45.16 R36.1 R37.1 13.97,47.94 IC5.8 | IC1.4 13.6,42.31 13.8,42.11 | 13.8,42.11 14.5,42.11 | IC1.5 12.95,42.26 13.1,42.11 13.8,42.11 | IC1.24 12.95,39.26 v13.3,39.61 | v8.4,56.11 8.4,56.91 8.35,56.96 | 8.35,56.96 8.95,57.56 R28.2 R29.2 R30.2 R31.2 R32.2 R33.2 15.55,57.56 v15.8,57.31 | R24.2 32.9,41.31 32.3,41.91 32.3,42.21 | v33.2,42.81 32.9,42.81 32.3,42.21 | 27.3,48.71 28.5,48.71 29,48.21 29,45.51 32.3,42.21 | 32.1,20.31 32.1,20.51 30.5,22.11 C12.1 28.95,23.86 R22.2 28.4,23.91 27.7,24.61 27.7,29.01 v28.1,29.41 | v8.4,25.71 8.4,28.21 v8.3,28.31 | v16.1,9.41 13.5,9.41 v13.2,9.71 | v20.2,12.91 20.3,13.01 v22.2,13.01 21.2,14.01 v21.2,14.11 22.9,15.81 v23.5,15.81 | v5,8.01 v7,6.01 | v5,4.01 v7,2.01 | v3,6.01 v3,2.01 | v7,13.01 v7,10.01 9,8.01 v10,8.01 12,6.01 16,6.01 v16.5,6.51 17.2,7.21 v20.9,7.21 21,7.31 v23.6,7.31 | v7,16.01 v7,19.01 | v4,33.01 3.8,32.81 v1.5,32.81 | v2,35.01 v2,49.01 | v2.1,59.11 3.2,59.11 v4.3,60.21 | CON1.14 38.8,6.59 v38.8,8.41 39.4,9.01 v41,9.01 | 33.8,11.41 35.9,11.41 36.9,12.41 v37.1,12.41 37.3,12.41 | IC3.1 31.9,13.11 v31.9,13.51 | v16,30.11 v17.7,31.81 16.9,31.81 v15.6,33.11 | v13.3,29.81 14.3,30.81 v14.3,31.81 12,31.81 v10.6,33.21 | v38.5,47.91 38.5,49.61 38.7,49.81 v38.7,50.51 39.4,51.21 v39.4,52.61 | v10.9,26.21 11.4,26.71 v11.4,27.61 15.46,27.61 v16.9,29.05 | v22.7,19.21 22.7,21.41 v21.9,22.21 20.9,23.21 v20.9,25.11 20.4,25.61 20.4,29.61 v19.5,30.51 | 5.6,41.11 5.2,40.71 v5.2,40.61 | 4.4,46.31 4,45.91 v4,45.31 3.1,44.41 v3.1,42.11
  Top 0.152: v38.8,11.51 39.9,11.51 v40.4,12.01 | v37.7,16.01 39.1,16.01 41.2,13.91 v41.7,13.91 | CON1.39 74.4,2.71 v75.9,1.21 | v80.6,1.61 80.6,2.21 81.2,2.81 81.2,6.91 v80.9,7.21 v80.9,11.61 | v76.5,7.61 73.9,7.61 v71.9,9.61 | v78.2,13.61 75.7,13.61 v75.4,13.31 73.4,13.31 72.7,14.01 62.3,14.01 v60.5,12.21 | v23.5,38.91 24.2,38.21 v24.2,37.21 | v70.3,7.91 68.3,7.91 v67.8,8.41
  Top 0.254: C15.1 49.97,11.25 SPI-LED.GND
  Bottom 0.152: T2.S 33.2,42.11 v33.2,42.81 | v4.6,50.31 4.6,48.81 v3.7,47.91 2.6,46.81 2.6,45.21 3.1,44.71 v3.1,42.11 2.9,41.91 2.9,38.01 v4.6,36.31 6.1,34.81 v9.4,34.81 | v38.9,35.91 37.6,37.21 TH.3 37.6,47.01 v38.5,47.91 | CH3.3 28.35,42.76 R18.2 | CON1.9 36.36,4.01 38.9,4.01 CON1.14 40.46,5.25 41.8,3.91 46.42,3.91 CON1.20 49,4.01 54.5,4.01 55.38,3.13 CON1.25 56.68,4.01 59.22,4.01 CON1.30 60.96,5.25 62.2,4.01 64.2,4.01 65.44,5.25 CON1.34 65.76,5.25 67,4.01 72.1,4.01 73.16,2.95 CON1.39 74.2,2.71 74.6,3.11 74.6,10.41 71.3,13.71 64.3,13.71 62.82,12.23 I2C0.GND | U5.13 23.88,20.64 C6.1 19.88,21.59 19.38,22.09 19.78,22.09 | 19.78,22.09 C7.1 | C10.1 17.3,18.81 18.6,17.51 20.5,17.51 v20.9,17.11 20.9,14.61 20.8,14.51 | C8.1 17.3,14.51 20.8,14.51 | C8.1 R7.2 | C8.1 17.15,14.66 17.15,13.41 | 17.15,13.41 C9.1 | CH1.3 27.2,56.61 29.9,59.31 36,59.31 37.6,57.71 ST.3 | 11.4,14.51 11.4,15.46 | 11.4,15.46 11.4,16.1 | 11.4,17.2 11.4,17.6 11.68,17.88 U$3.21 | 11.4,17.2 11.4,17.11 | 11.4,17.11 11.4,16.61 | 11.4,16.61 11.4,16.1 | 11.4,17.11 | 11.4,16.61 11.68,16.88 U$3.23 | 11.98,20.21 12,20.21 12.33,19.88 U$3.17 | 11.98,20.21 10.9,20.21 v10.6,20.51 | 11.47,22.51 11.46,22.51 v11.06,22.11 11.29,21.88 U$3.13 | 11.47,22.51 12.1,22.51 12.23,22.38 U$3.12 | C9.1 17.15,12.86 16.4,12.11 14.2,12.11 v14,12.31 14,11.61 v14.8,10.81 | v18.6,13.71 18.3,13.41 17.2,13.41 | 17.2,13.41 17.15,13.41 | v20.9,25.11 20.9,26.16 R12.1 20.2,27.81 18.6,29.41 | v21.9,22.21 21.78,22.09 19.78,22.09 | v35.9,19.81 34.5,18.41 v33.6,18.41 | v11,13.81 11.4,14.21 11.4,14.51 | v13.3,39.61 v15.8,39.61 18,37.41 v18,34.61 17.2,33.81 17.2,32.31 v17.7,31.81 19,30.51 v19.5,30.51
  Bottom 0.152: v8.4,56.11 8.4,53.71 9.3,52.81 v9.3,52.01 10,52.71 v11.4,52.71 | 13.6,61.21 14.9,59.91 v15.3,59.91 15.8,59.41 v15.8,57.31 | 13.6,61.21 6.6,61.21 5.5,60.11 v5.5,58.91 | T3.S 27.2,38.81 CH3.3 | U5.13 26.32,19.73 27.4,20.81 27.4,21.51 v33.5,27.61 38.2,32.31 v38.2,32.41 38.2,30.51 v38.1,30.41 | v9.3,22.71 8.4,23.61 v8.4,25.71 8.9,26.21 v10.9,26.21 | v8.3,28.31 8.3,30.51 v8,30.81 9.3,32.11 11.4,32.11 v12.7,33.41 13,33.11 v15.6,33.11 | C9.1 17.15,10.46 v16.1,9.41 16.9,8.61 v17.8,8.61 | v13.2,9.71 16.4,6.51 v16.5,6.51 | v20.9,7.21 20.9,7.61 22.2,8.91 v22.2,13.01 | v7,10.01 v5,8.01 | v7,6.01 v5,4.01 v3,6.01 | v7,13.01 v7,16.01 | v7,19.01 6,20.01 6,31.01 v4,33.01 | v1.5,32.81 1.5,34.51 v2,35.01 | v2,49.01 1.1,49.91 1.1,58.11 v2.1,59.11 | 13.6,61.21 18.8,61.21 v21,59.01 | U5.13 28,16.52 28,14.01 v27,13.01 | v31.1,7.31 32.2,8.41 v38.8,8.41 | v31.9,13.51 31.7,13.71 31.7,17.01 33.1,18.41 v33.6,18.41 | v33.6,18.41 34.1,17.91 34.1,16.71 35.4,15.41 v36,15.41 | v14.3,31.81 v16,30.11 17.8,30.11 v18.5,29.41 | v18.5,29.41 18.6,29.41 | 18.6,29.41 21.4,29.41 v21.5,29.31 | v10.6,33.21 9,33.21 v8.8,33.41 | v39.4,52.61 39.4,58.81 v39.3,58.91 | v31.3,52.31 30.4,53.21 v30.4,56.01 | v30.6,49.21 30.6,48.01 v31.2,47.41 | v32.8,32.11 33,31.91 v35.9,31.91 34.3,33.51 v34.3,33.81 | v28.1,29.41 v28.1,32.11 | v26.1,8.31 25.1,7.31 v23.6,7.31 | v23.5,15.81 23.7,15.81 24.7,14.81 26.4,14.81 v26.5,14.71 | v5.2,40.61 5.5,40.61 6.3,39.81 v9,39.81 | v21,59.01 20.1,58.11 v20.1,56.01 20.1,53.91 21.1,52.91 22.6,52.91 v23.1,53.41 | v35.6,9.81 35.6,10.91 v37.1,12.41 37.9,12.41 v38.8,11.51 41,9.31 v41,9.01 41.5,8.51 44.1,8.51 v44.6,9.01
  Bottom 0.152: v18.2,11.91 17.2,12.91 17.2,13.41 | 20.8,14.51 v21.2,14.11 | v2.1,59.11 3.6,57.61 v3.6,57.31 | v2.1,59.11 2.1,60.81 v2.3,61.01 | v33.6,18.41 35,18.41 37.4,16.01 v37.7,16.01 | v41.7,13.91 54.9,13.91 v55.5,13.31 | v21,59.01 23.2,61.21 v29.9,61.21 | v75.9,1.21 80.2,1.21 v80.6,1.61 | v80.9,7.21 76.9,7.21 v76.5,7.61 | v71.9,9.61 70.3,8.01 v70.3,7.91 | v80.9,11.61 78.9,13.61 v78.2,13.61 | v60.5,12.21 60.5,11.51 v58.5,9.51 | CH3.3 25.1,39.51 24.1,39.51 v23.5,38.91 | U$3.25 11.82,15.88 11.4,15.46 | U$3.24 11.68,16.38 11.4,16.1 | U$3.22 11.58,17.38 11.4,17.2 | U$3.16 12.15,20.38 11.98,20.21 | U$3.10 11.86,23.38 | 11.47,22.51 11.47,22.99 11.86,23.38 | U$3.29 12.03,13.88 11.4,14.51 | U$3.8 12.12,24.38 11.83,24.09 11.83,23.41 11.86,23.38 | v18.5,29.41 17.26,29.41 v16.9,29.05
  pour Bottom (rank 6): -2.7,65.69 83.9,65.69 83.9,-19.89 -2.7,-19.89
  pour Top (rank 6): -4.7,67.2 85.5,67.2 85.5,-21.09 -4.7,-21.09
LED0
  Top 0.152: IC1.6 R3.1
LED1
  Top 0.152: IC1.7 11.65,44.66 R4.1
MOSI1
  Top 0.152: IC3.2 32.1,11.41 29.8,13.71 29.8,19.79 24.79,24.8 U5.11
MOSI2
  Top 0.152: LED1.SDO 42.63,13.74 43.2,14.31 55.68,14.31 56.72,13.27 SPI-LED.DI
MOSI_HV
  Top 0.152: LED1.SDI 42.46,11.25 40.5,13.21 39.2,13.21 37,11.01 36.1,11.01 35.85,10.76 IC3.4
MUX_SELECT  (via drill 0.35)
  Top 0.152: T5.C 4.9,55.91 4.9,54.71 5.3,54.31 v5.3,53.91 | R38.2 7.1,50.01 7.9,49.21 v7.9,48.71 9.32,48.71 IC5.1 9.42,47.73 R41.2
  Bottom 0.152: v7.9,48.71 7.9,48.81 5.9,50.81 5.9,53.31 v5.3,53.91
N$2
  Top 0.152: R33.1 14.6,56.21 13.97,55.58 IC5.9
N$3
  Bottom 0.152: U$3.2 14.7,27.38 C5.2
N$4
  Top 0.152: IC5.10 13.32,56.18 R32.1
N$6
  Top 0.152: U4.2 28.96,34.18 29.26,34.47 R21.1
N$9
  Top 0.152: U3.4 32.8,37.71 R20.1
N$12
  Top 0.152: U3.1 36.6,37.66 R19.1
N$14
  Bottom 0.152: U$3.26 14.3,15.38 15.18,16.26 R7.1
N$16
  Bottom 0.152: U$3.4 16.41,26.38 16.57,26.23 C4.2
N$17
  Bottom 0.152: U$3.28 13.99,14.38 15.06,13.31 C9.2
N$18
  Bottom 0.152: R10.2 14.91,21.64 14.89,21.61 14.66,21.38 U$3.14
N$19
  Top 0.152: IC5.11 12.6,54.68 R31.1
N$20
  Top 0.152: IC5.12 12.02,55.94 11.6,56.36 R30.1
N$21
  Bottom 0.152: U$3.5 14.66,25.88 C4.1
N$22
  Bottom 0.152: U$3.3 14.27,26.88 14.4,26.75 15.67,26.75 C5.1
N$23  (via drill 0.35)
  Top 0.152: R24.1 31.5,39.61 R23.1 30.35,39.56 v29.92,39.13
  Bottom 0.152: T3.G 26.5,37.61 28.4,37.61 v29.92,39.13
N$24
  Top 0.152: R27.2 39.1,38.91 RC.CATHODE
N$25
  Bottom 0.152: U$3.27 15.33,14.88 C8.2
N$26  (via drill 0.35)
  Top 0.152: v28.7,36.51 29.7,36.51 R21.2
  Bottom 0.152: v28.7,36.51 28.45,36.26 T3.D
N$28  (via drill 0.35)
  Top 0.152: U3.3 34.06,37.88 v34.1,37.91
  Bottom 0.152: v34.1,37.91 33.8,38.21 33.8,39.11 33.6,39.31 T2.D
N$30
  Top 0.152: U3.2 35.34,37.95 T1.D
N$31
  Top 0.152: R29.1 11,56.16 11,55.81 11.37,55.44 IC5.13
N$32
  Bottom 0.152: D1.ANODE 18.9,16.11 17.4,17.61 16,17.61 15.25,18.36 C10.2 15.3,18.86 R9.2 15.3,20.31 16.57,21.59 R10.1
N$33
  Top 0.152: R15.2 35.31,40.56 35.55,40.31 T1.G 36.4,40.36 R17.1
N$35
  Top 0.152: R28.1 9.9,56.26 9.9,55.91 10.1,55.71 10.5,55.71 10.72,55.49 IC5.14
N$37  (via drill 0.35)
  Top 0.152: v10.7,24.41 11,24.11 v17.4,24.11
  Bottom 0.152: R12.2 18.2,25.91 R11.1 18.65,25.36 v17.4,24.11 | v10.7,24.41 10.6,24.41 10.3,24.11 10.3,21.81 11.23,20.88 U$3.15
N$38
  Bottom 0.152: T2.G 30.9,42.51 R18.1 30.9,43.67 R16.2
N$40
  Top 0.152: IC6.4 9.2,61.67 C17.2
  pour Top (no thermals): 8,61.41 8,61.81 8.2,62.01 10.5,62.01 10.8,61.71 10.8,60.91 10.5,60.61 9.5,60.61 9.1,61.01 8.4,61.01
N$50
  Bottom 0.152: R8.2 14.67,22.88 U$3.11
OE  (via drill 0.35)
  Top 0.152: v5.7,42.21 5.7,43.21 6.5,44.01 T4.C | IC1.23 12.3,39.61 11.5,40.41 v10.5,40.41 | R40.2 6.36,36.76 v6.36,37.31 | v16.5,37.31 17,36.81 17,36.01 R2.1
  Bottom 0.152: v6.36,37.31 4.2,39.47 4.2,41.51 4.9,42.21 v5.7,42.21 6.8,41.11 9.8,41.11 v10.5,40.41 10.5,38.21 11.4,37.31 v16.5,37.31
PCH1
  Top 0.152: R13.1 16.05,56.46 16.7,57.11 20.8,57.11 CH1.1
PCH1_3V3
  Top 0.152: U3.7 35.34,24.41 33.94,23.01 33.94,19.98 36.72,17.19 U5.1
PCH2
  Top 0.152: R14.1 18.5,56.11 22.2,52.41 CH2.1
PCH2_3V3
  Top 0.152: U3.6 34.06,26.58 34.3,26.81 37.2,26.81 37.54,26.47 37.54,24.07 38.3,23.31 38.3,20.86 39.43,19.73 U5.2
PCH3_XAIO
  Top 0.152: R22.1 28.96,25.58 U4.3 28.96,28.08 30.1,29.21 35.9,29.21 38.15,26.96 38.15,24.35 40.03,22.47 U5.3
PCH_3  (via drill 0.35)
  Top 0.152: R23.2 28.6,44.01 v28.6,44.41
  Bottom 0.152: v28.6,44.41 27.9,45.11 23.8,45.11 22.2,43.51 CH3.1
RC_CH1_ST  (via drill 0.35)
  Top 0.152: v18.9,41.11 18.84,41.11 17.52,42.43 R34.2
  Bottom 0.152: v18.9,41.11 18.9,39.68 23.97,34.61 30.5,34.61 31.3,35.41 35.5,35.41 36.1,34.81 39.5,34.81 40,35.31 40,50.61 38.4,52.21 34,52.21 32.6,53.61 ST.1
RC_CH2_TH  (via drill 0.35)
  Top 0.152: R35.2 19.23,45.38 v20.1,44.51
  Bottom 0.152: v20.1,44.51 20.3,44.31 20.3,39.81 24.8,35.31 29.1,35.31 30.6,36.81 34.4,36.81 36.5,38.91 36.5,40.81 TH.1
RCH1
  Top 0.152: IC5.4 11.37,49.68 13.7,52.01 16.9,52.01 17.7,51.21 17.7,51.01 19.9,48.81 19.9,47.91 21.3,46.51 21.3,43.91 20.62,43.23 18.52,43.23 R34.1 16.82,44.23 16.4,44.66 R36.2
RCH2
  Top 0.152: R35.1 16.53,46.98 R37.2 16.4,48.51 14.9,50.01 13.7,50.01 13.32,49.63 IC5.7
RECV_CH1
  Top 0.152: IC5.3 10.72,49.93 14,53.21 R25.2
RECV_CH1_H  (via drill 0.35)
  Top 0.152: R13.2 16.15,54.43 16.15,53.76 R25.1 16.91,53.21 19.31,50.81 v20.8,50.81 | v20.8,50.81 | v38.5,42.71 38.3,42.51 37.84,42.51 R15.1
  Bottom 0.152: v20.8,50.81 36.8,50.81 39.14,48.47 39.14,43.35 v38.5,42.71
RECV_CH2
  Top 0.152: R26.2 15,50.81 14.8,51.01 13.6,51.01 12.67,50.08 IC5.6
RECV_CH2_H  (via drill 0.35)
  Top 0.152: v19.5,52.21 19.5,52.81 17.8,54.51 R14.2 | v18.8,47.71 17.6,48.91 17.6,49.91 R26.1
  Bottom 0.152: R16.1 29.4,46.76 19.55,46.76 18.8,47.51 v18.8,47.71 19.5,48.41 v19.5,52.21
SCK1
  Top 0.152: IC4.2 31.9,15.31 31,16.21 31,20.11 26.6,24.51 26.6,29.21 25.92,29.89 U5.9
SCL  (via drill 0.35)
  Top 0.152: v7.3,23.91 6.8,24.41 6.8,32.18 3.69,35.29 3.69,37.81 8.5,42.61 10.9,42.61 11.2,42.31 v11.4,42.31 | v28.7,19.2 28.7,13.11 29.8,12.01 v29.8,11.41 | CON1.5 28.7,3.99 28.7,6.41 28.1,7.01 v28.1,7.51 | IC1.26 14.25,39.96 13.6,40.61 v13.5,40.61
  Bottom 0.152: 10.1,19.61 8.5,18.01 8.5,5.41 9.55,4.37 R5.1 9.61,4.3 13.3,0.61 27.88,0.61 CON1.5 31.2,3.93 31.2,6.01 32.12,6.93 67.9,6.93 68.83,7.86 I2C0.SCL | 10.1,19.61 7.3,22.41 v7.3,23.91 | U5.6 38.95,28.81 36.1,28.81 28.7,21.41 v28.7,19.2 | v29.8,11.41 29.8,9.21 v28.1,7.51 | v13.5,40.61 13.1,40.61 v11.4,42.31 | U$3.18 10.32,19.38 10.1,19.61
SDA  (via drill 0.35)
  Top 0.152: CON1.3 27.44,2.15 26.5,1.21 17.05,1.21 16.5,1.77 v16.5,2.51 | IC1.27 14.9,40.69 14.08,41.51 8.9,41.51 5.4,38.01 5.4,35.41 9.6,31.21 9.6,25.01 8.3,23.71 8.3,21.91 8.9,21.31 8.9,19.31 v10.2,18.01 10.2,9.91 v12.1,8.01
  Bottom 0.152: v10.2,18.01 11.07,18.89 11.08,18.88 11.34,18.88 | 30.7,8.41 28.7,6.41 28.7,3.71 27.7,2.71 CON1.3 | U5.5 37.63,24.95 37.63,24.05 30.7,17.12 30.7,8.41 | v12.1,8.01 12.15,8.01 R6.1 16.5,3.67 v16.5,2.51 | 30.7,8.41 31.4,9.11 37.3,9.11 37.9,9.71 39,9.71 40.92,7.79 65.99,7.79 66.82,8.62 I2C0.SDA | U$3.19 11.34,18.88 | U$3.20 11.84,18.38 11.34,18.88
SIGNAL_SELCET  (via drill 0.35)
  Top 0.152: U5.4 40.03,24.91 38.77,26.17 38.77,28.34 36.4,30.71 27.8,30.71 26.9,31.61 26.9,33.41 25.7,34.61 22.6,34.61 v20.7,36.51 | v7,54.01 T5.B | R41.1 8.7,45.41 v7.9,45.41
  Bottom 0.152: v20.7,36.51 20.2,36.51 8.8,47.91 | 8.8,47.91 8.8,49.11 8.1,49.81 8.1,52.71 7,53.81 v7,54.01 | v7.9,45.41 7.6,45.41 7.1,45.91 7.1,46.61 7.6,47.11 8,47.11 8.8,47.91

### Text on the board
tPlace: RECEIVER | SERVO | S | S | S | ESC | S | S | 7 | 3V3 | GND | VUSB | D0 | SPI-LED | I 2 C | #612 | 2 | 10 | 20 | 30 | 40 | Rev 3.0.11
bPlace: #612 | Rev 3.0.8 | S/N | D7 | D6 | 3V3 | GND | D0 | VUSB | F-612-3-0-11-A-N-J-1-JLC
Document: #612 JetRacer Rev 3.0.11 / 2025/02/04 / *Jetson Nano Compatible
_tNames: MC74VHC157 | FDN335N | FDN335N | TLP2270 | Jetson Orin Nano Border FAN | OLED 0.96inch SD1306 Blue | Jetson Nano Border FAN | SN74AHCT1G125 | SN74AHCT1G125